# Altium project BE-PC_EXP_V100.PrjPcb (part 1 of 4)
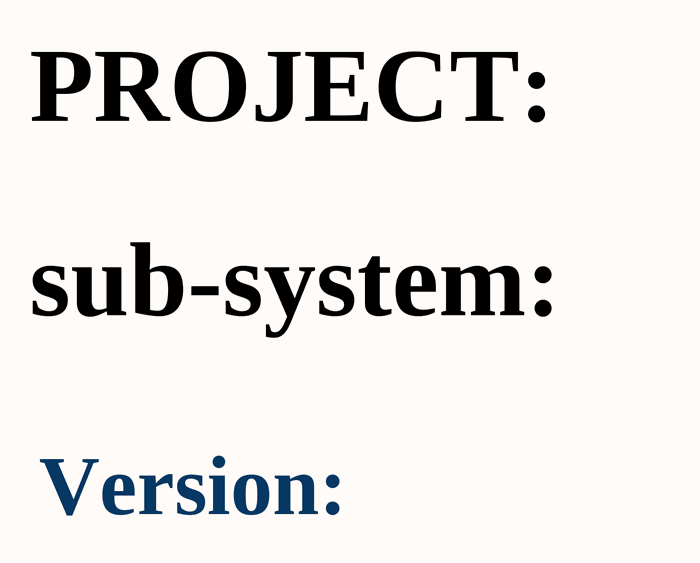
[diagram p0: 01_COVER PAGE.SchDoc]
ApprovedBy: Vu Pham; CheckedBy: Bao Bui; Date: 10/29/2025; DrawnBy: Cam Doan; MasterProject: BEE-PC; Revision: 1.0.0; SubSystem: EXP
29 sheets, 1256 parts. Net scope: flat (ports and power ports of the same name join across sheets).
Board file: BEE-PC_EXP_V100.PcbDoc
Sheets:
  01_COVER PAGE.SchDoc
  02_BLOCK DIAGRAM.SchDoc
  03_INDEX.SchDoc
  04_CONNECTOR_IN.SchDoc
  04_CONNECTOR_OUT.SchDoc
  04_CONNECTOR_OUT_2.SchDoc
  05_POWER_SAMA7.Doc.SchDoc
  05_POWER_MCU_1.SchDoc
  05_POWER_MCU_2.SchDoc
  06_SOM_USB_CARD.SchDoc
  06_SOM_Console.SchDoc
  06_SOM_CAM.SchDoc
  07_eMMC.SchDoc
  07_USB.SchDoc
  08_MCU.SchDoc
  09_MRAM_RTC_WDT.SchDoc
  10_NTC_TEMPSENSOR.SchDoc
  11_HEATER.SchDoc
  12_TEC.SchDoc
  13_FLOW_Sensor.SchDoc
  13_Sensors_Onboard.SchDoc
  14_HD4_PUMP.SchDoc
  15_SOLEDNOID.SchDoc
  15_SOLENOID 2.SchDoc
  MOUTING.SchDoc
  06_SAMA7G54-PMIC.SchDoc
  06_SAMA7G54-MPU.SchDoc
  06_SAMA7G54-PIO.SchDoc
  06_SAMA7G54-DDR3.SchDoc

## Sheet 01_COVER PAGE.SchDoc
size 420 x 297 mm; SheetNumber: 1; SheetTotal: 28

### Notes on the sheet
- PROJECT:
- sub-system:
- Version:
- Project:
- Sub-system:
- Design by:
- Sheet title:
- Sheet
- of
- Checked by:
- Approved by:
- Revision:
- Document No:
- Size:
- Date:
- A3

## Sheet 02_BLOCK DIAGRAM.SchDoc
size 420 x 297 mm; SheetNumber: 2; SheetTotal: 28

### Notes on the sheet
- Project:
- Sub-system:
- Design by:
- Sheet title:
- Sheet
- of
- Checked by:
- Approved by:
- Revision:
- Document No:
- Size:
- Date:
- A3

## Sheet 03_INDEX.SchDoc
size 420 x 297 mm; SheetNumber: 3; SheetTotal: 28
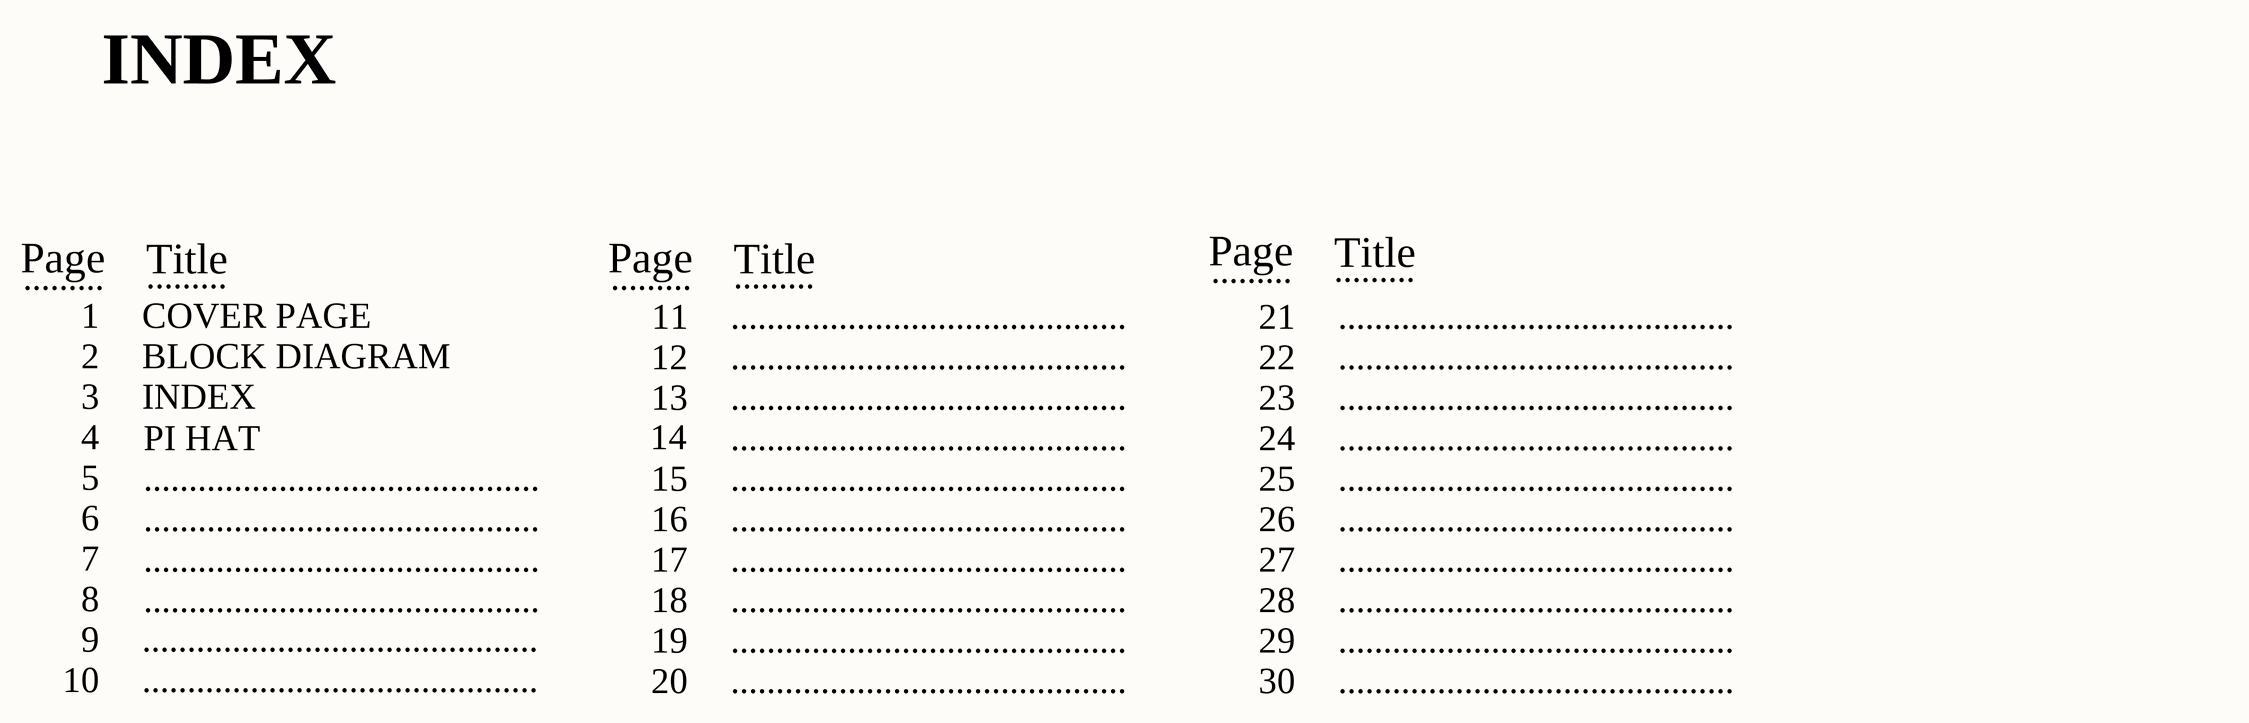
[diagram p1: 03_INDEX.SchDoc]

### Notes on the sheet
- INDEX
- Page
- .........
- Title
- 1
- 2
- COVER PAGE
- BLOCK DIAGRAM
- 11
- 12
- ............................................
- 21
- 22
- 3
- 4
- 14
- 13
- 23
- 5
- PI HAT
- 15
- 24
- 25
- 6
- 7
- 16
- 17
- 26
- 27
- 8
- 18
- 28
- 9
- 10
- 19
- 20
- 29
- 30
- Project:
- Sub-system:
- Design by:
- Sheet title:
- Sheet
- of
- Checked by:
- Approved by:
- Revision:
- Document No:
- Size:
- Date:
- A3

## Sheet 04_CONNECTOR_IN.SchDoc
size 420 x 297 mm; SheetNumber: 4; SheetTotal: 29
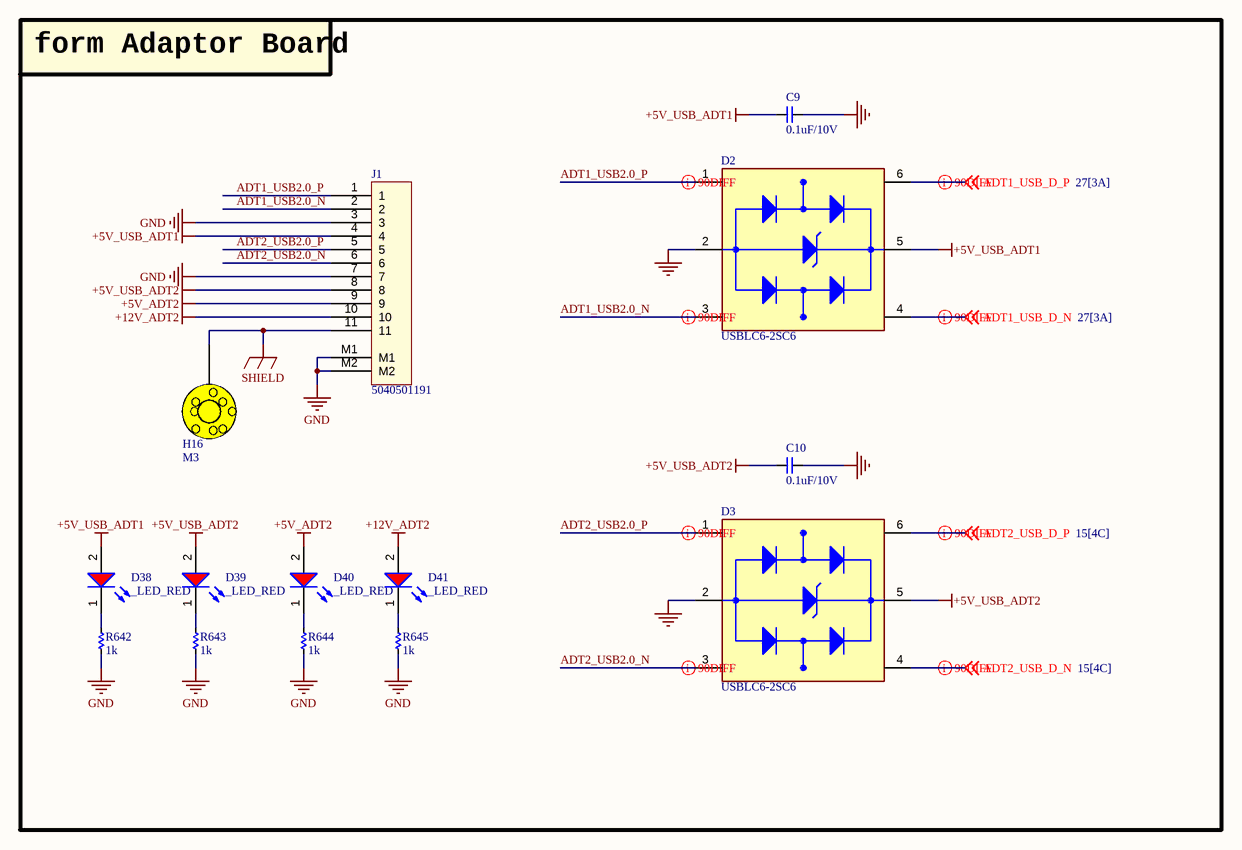
[diagram p2: 04_CONNECTOR_IN.SchDoc]

### Parts
C9  0.1uF/10V  [CAP_C_1005X60]
C10  0.1uF/10V  [CAP_C_1005X60]
D2  USBLC6-2SC6  [SOT95P280X145-6N]
D3  USBLC6-2SC6  [SOT95P280X145-6N]
D38  _LED_RED  [LED_0603]
D39  _LED_RED  [LED_0603]
D40  _LED_RED  [LED_0603]
D41  _LED_RED  [LED_0603]
H16  M3  [Testpoint_TH_D350H250]
J1  5040501191  [MOLEX_5040501191]
R642  1k  [RES_C_1005X40]
R643  1k  [RES_C_1005X40]
R644  1k  [RES_C_1005X40]
R645  1k  [RES_C_1005X40]

### Blocks framed on the sheet
form Adaptor Board: C9 C10 D2 D3 D38-D41 H16 J1 R642-R645

### Nets
+5V_ADT2: D40.2(A) J1.9
+5V_USB_ADT1: C9.2 D2.5(VBUS) D38.2(A) J1.4
+5V_USB_ADT2: C10.2 D3.5(VBUS) D39.2(A) J1.8
+12V_ADT2: D41.2(A) J1.10
GND: C9.1 C10.1 D2.2(GND) D3.2(GND) J1.3 J1.7 J1.M1 J1.M2 R642.1 R643.1 R644.1 R645.1
SHIELD: H16.1 J1.11
ADT1_USB2.0_N: D2.3(I/O2_IN) J1.2
ADT1_USB2.0_P: D2.1(I/O1_IN) J1.1
ADT1_USB_D_N: D2.4(I/O2_OUT) ; off-sheet ADT1_USB_D_N
ADT1_USB_D_P: D2.6(I/O1_OUT) ; off-sheet ADT1_USB_D_P
ADT2_USB2.0_N: D3.3(I/O2_IN) J1.6
ADT2_USB2.0_P: D3.1(I/O1_IN) J1.5
ADT2_USB_D_N: D3.4(I/O2_OUT) ; off-sheet ADT2_USB_D_N
ADT2_USB_D_P: D3.6(I/O1_OUT) ; off-sheet ADT2_USB_D_P
NetD38_1: D38.1(K) R642.2
NetD39_1: D39.1(K) R643.2
NetD40_1: D40.1(K) R644.2
NetD41_1: D41.1(K) R645.2

### Layout directives
differential pair; differential pair class DIFF90: ADT1_USB2.0_N, ADT1_USB2.0_P, ADT1_USB_D_N, ADT1_USB_D_P, ADT2_USB2.0_N, ADT2_USB2.0_P, ADT2_USB_D_N, ADT2_USB_D_P

### Notes on the sheet
- Project:
- Sub-system:
- Design by:
- Sheet title:
- Sheet
- of
- Checked by:
- Approved by:
- Revision:
- Document No:
- Size:
- Date:
- A3

### Library data of the parts
C9 C10 = _CAP_C_2: CAP CHIP
D2 D3 = USBLC6-2SC6: 17V Clamp 5A (8/20Âµs) Ipp Tvs Diode Surface Mount SOT-23-6; MF: STMicroelectronics; Value: *; SnapEDA_Link: https://www.snapeda.com/parts/USBLC6-2SC6/STMicroelectronics/view-part/?ref=snap; Check_prices: https://www.snapeda.com/parts/USBLC6-2SC6/STMicroelectronics/view-part/?ref=eda; Purchase-URL: https://pricing.snapeda.com/search/part/USBLC6-2SC6/?ref=eda; Price: None; Availability: In Stock; Package: SOT-23-6 STMicroelectronics; MP: USBLC6-2SC6
H16 = HEX-M3
J1 = Header 11x1_2M
R642-R645 = _RES_B_2: RES

## Sheet 04_CONNECTOR_OUT.SchDoc
size 420 x 297 mm; SheetNumber: 5; SheetTotal: 28
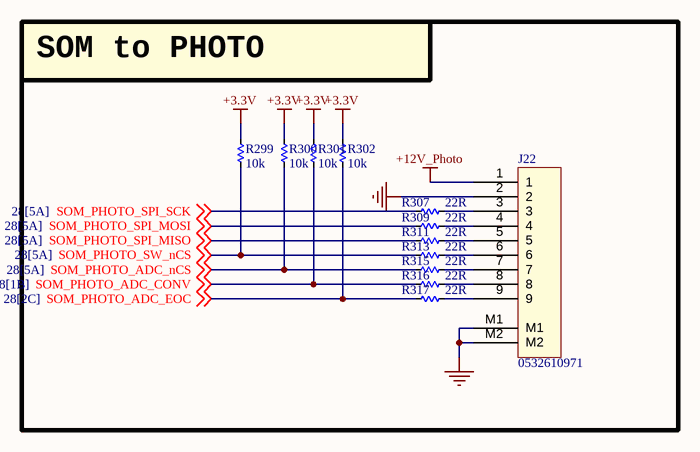
[diagram p3: 04_CONNECTOR_OUT.SchDoc]

### Parts
J22  0532610971  [MOLEX_0532610971]
R299  10k  [RES_C_1005X40]
R300  10k  [RES_C_1005X40]
R301  10k  [RES_C_1005X40]
R302  10k  [RES_C_1005X40]
R307  22R  [RES_C_1005X40]
R309  22R  [RES_C_1005X40]
R311  22R  [RES_C_1005X40]
R313  22R  [RES_C_1005X40]
R315  22R  [RES_C_1005X40]
R316  22R  [RES_C_1005X40]
R317  22R  [RES_C_1005X40]

### Blocks framed on the sheet
SOM to PHOTO: J22 R299-R302 R307 R309 R311 R313 R315-R317

### Nets
+3.3V: R299.1 R300.1 R301.1 R302.1
+12V_Photo: J22.1
GND: J22.2 J22.M1 J22.M2
SOM_PHOTO_ADC_CONV: R301.2 R316.1 ; off-sheet SOM_PHOTO_ADC_CONV
SOM_PHOTO_ADC_EOC: R302.2 R317.1 ; off-sheet SOM_PHOTO_ADC_EOC
SOM_PHOTO_ADC_nCS: R300.2 R315.1 ; off-sheet SOM_PHOTO_ADC_nCS
SOM_PHOTO_SPI_MISO: R311.1 ; off-sheet SOM_PHOTO_SPI_MISO
SOM_PHOTO_SPI_MOSI: R309.1 ; off-sheet SOM_PHOTO_SPI_MOSI
SOM_PHOTO_SPI_SCK: R307.1 ; off-sheet SOM_PHOTO_SPI_SCK
SOM_PHOTO_SW_nCS: R299.2 R313.1 ; off-sheet SOM_PHOTO_SW_nCS
NetJ22_3: J22.3 R307.2
NetJ22_4: J22.4 R309.2
NetJ22_5: J22.5 R311.2
NetJ22_6: J22.6 R313.2
NetJ22_7: J22.7 R315.2
NetJ22_8: J22.8 R316.2
NetJ22_9: J22.9 R317.2

### Notes on the sheet
- Project:
- Sub-system:
- Design by:
- Sheet title:
- Sheet
- of
- Checked by:
- Approved by:
- Revision:
- Document No:
- Size:
- Date:
- A3

### Library data of the parts
J22 = Header 9x1_2M
R299-R302 R307 R309 R311 R313 R315-R317 = _RES_B_2: RES

## Sheet 04_CONNECTOR_OUT_2.SchDoc
size 420 x 297 mm; SheetNumber: 6; SheetTotal: 29
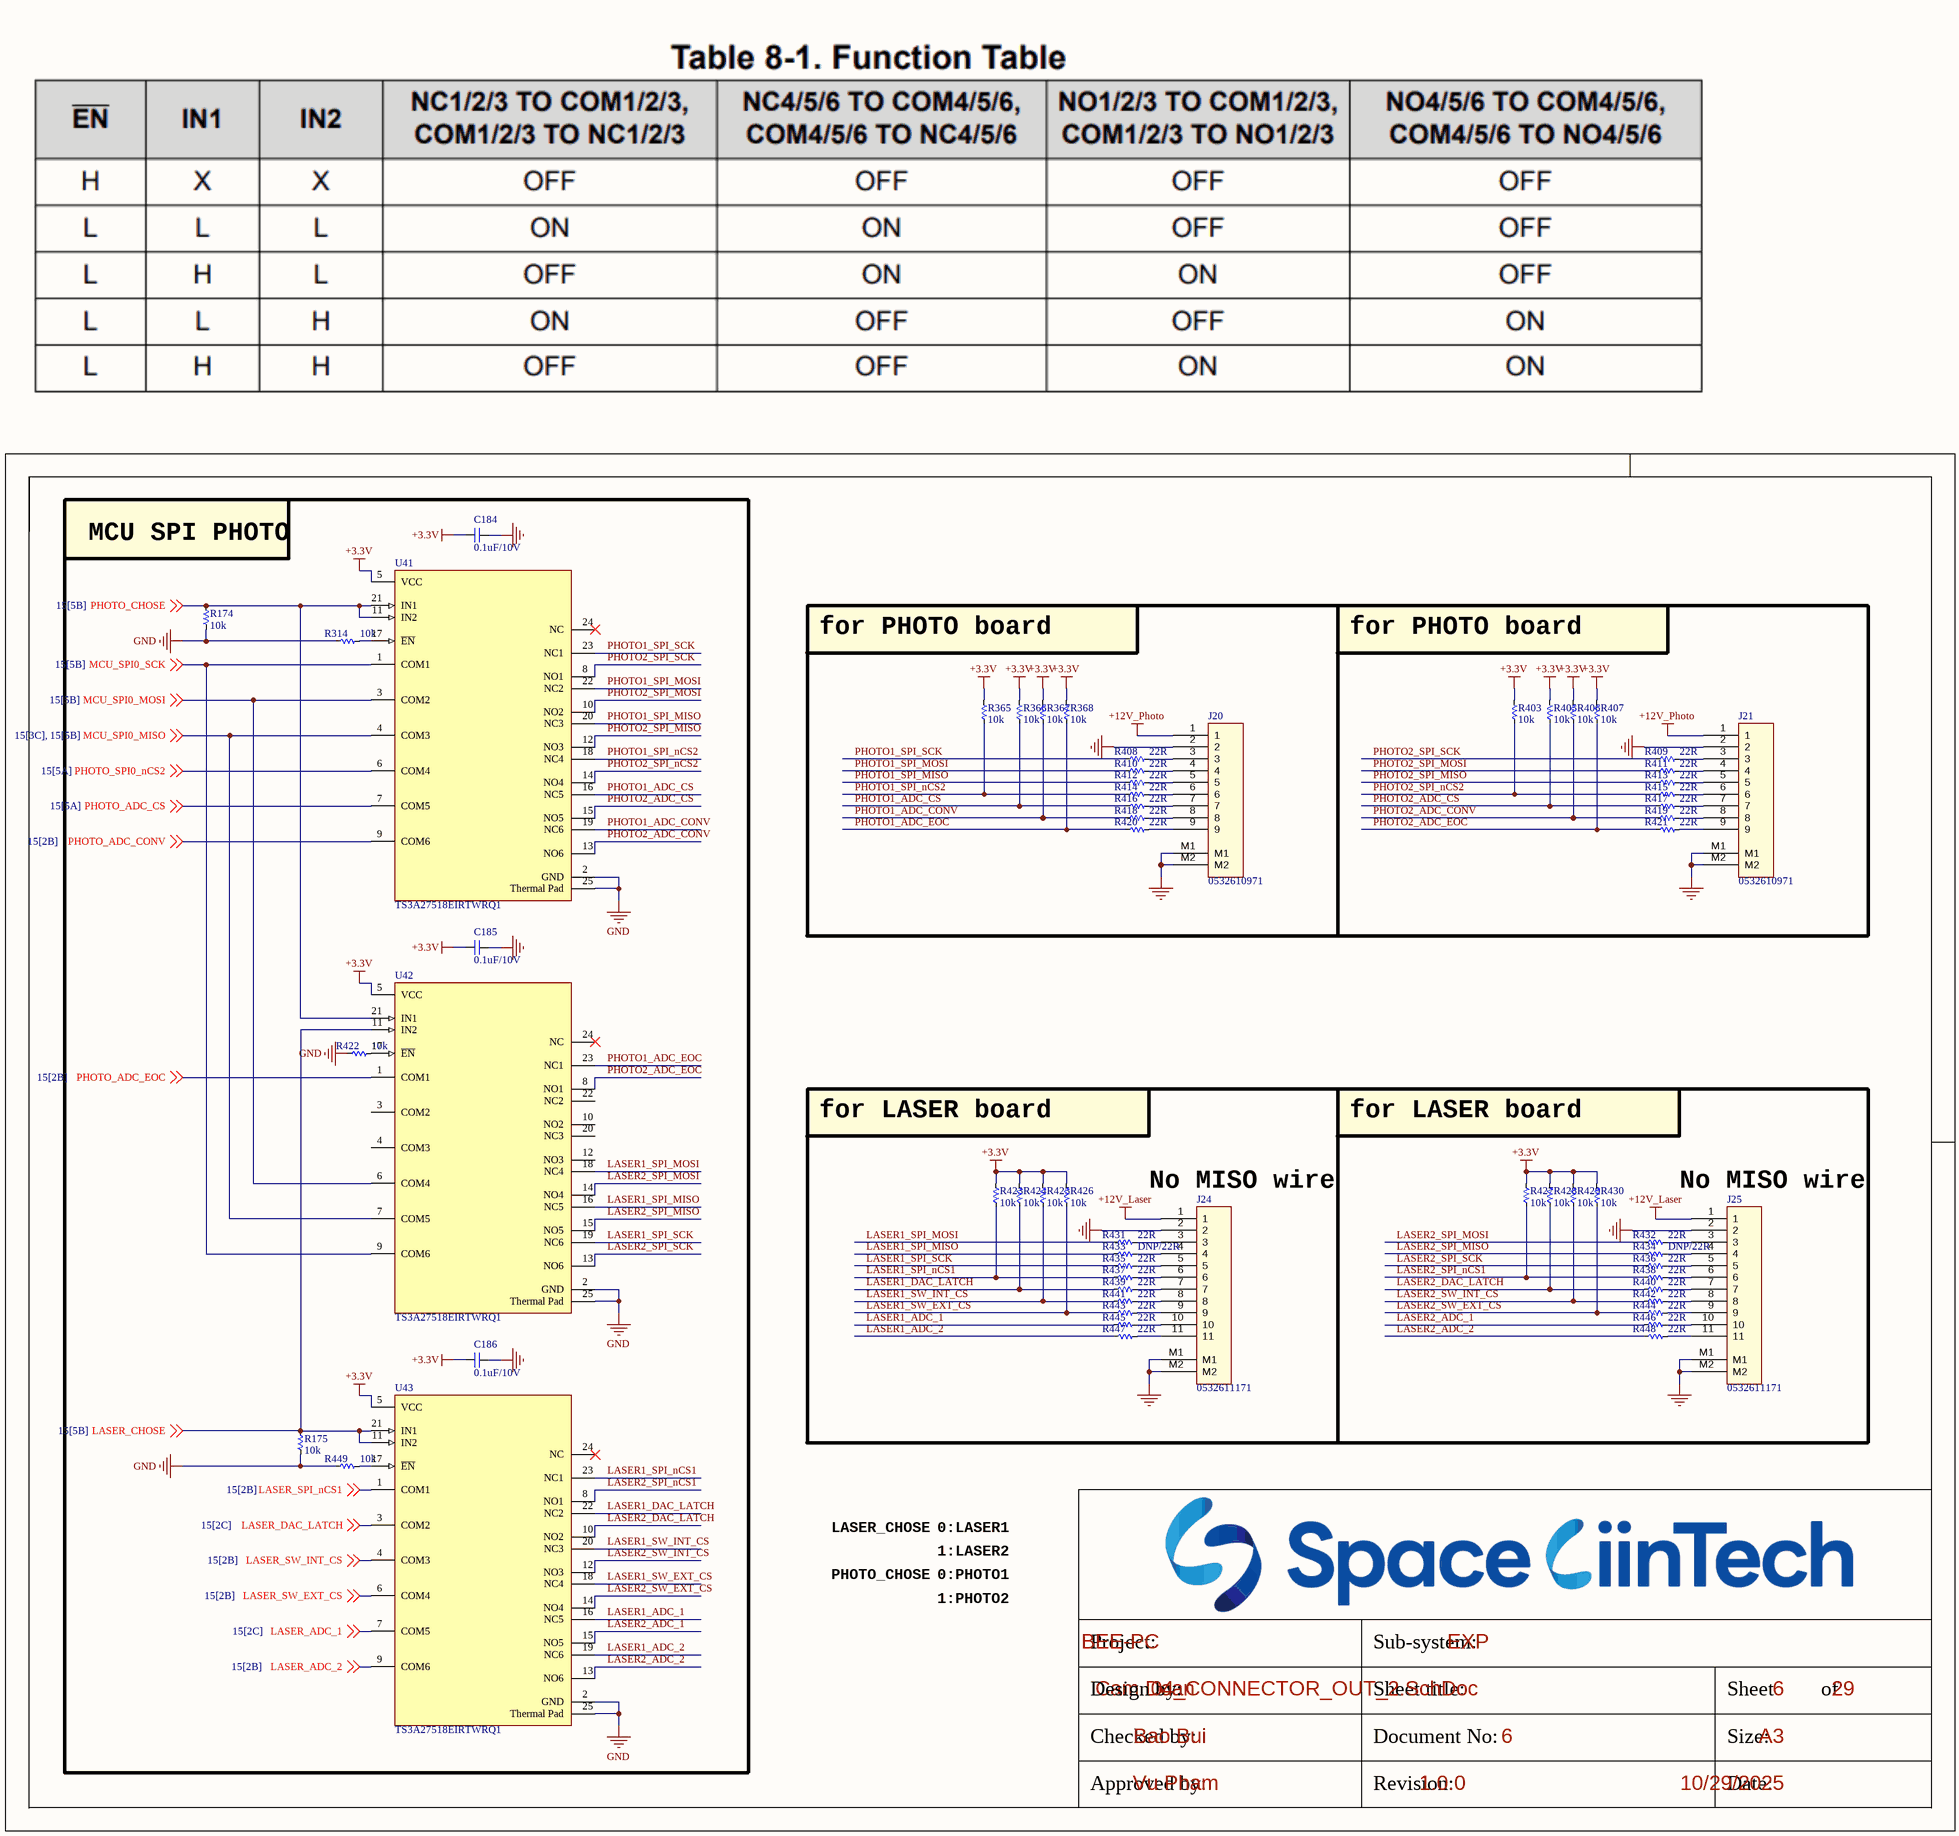
[diagram p4: 04_CONNECTOR_OUT_2.SchDoc]

### Parts
C184  0.1uF/10V  [CAP_C_1005X60]
C185  0.1uF/10V  [CAP_C_1005X60]
C186  0.1uF/10V  [CAP_C_1005X60]
J20  0532610971  [MOLEX_0532610971]
J21  0532610971  [MOLEX_0532610971]
J24  0532611171  [MOLEX_0532611171]
J25  0532611171  [MOLEX_0532611171]
R174  10k  [RES_C_1005X40]
R175  10k  [RES_C_1005X40]
R314  10k  [RES_C_1005X40]
R365  10k  [RES_C_1005X40]
R366  10k  [RES_C_1005X40]
R367  10k  [RES_C_1005X40]
R368  10k  [RES_C_1005X40]
R403  10k  [RES_C_1005X40]
R405  10k  [RES_C_1005X40]
R406  10k  [RES_C_1005X40]
R407  10k  [RES_C_1005X40]
R408  22R  [RES_C_1005X40]
R409  22R  [RES_C_1005X40]
R410  22R  [RES_C_1005X40]
R411  22R  [RES_C_1005X40]
R412  22R  [RES_C_1005X40]
R413  22R  [RES_C_1005X40]
R414  22R  [RES_C_1005X40]
R415  22R  [RES_C_1005X40]
R416  22R  [RES_C_1005X40]
R417  22R  [RES_C_1005X40]
R418  22R  [RES_C_1005X40]
R419  22R  [RES_C_1005X40]
R420  22R  [RES_C_1005X40]
R421  22R  [RES_C_1005X40]
R422  10k  [RES_C_1005X40]
R423  10k  [RES_C_1005X40]
R424  10k  [RES_C_1005X40]
R425  10k  [RES_C_1005X40]
R426  10k  [RES_C_1005X40]
R427  10k  [RES_C_1005X40]
R428  10k  [RES_C_1005X40]
R429  10k  [RES_C_1005X40]
R430  10k  [RES_C_1005X40]
R431  22R  [RES_C_1005X40]
R432  22R  [RES_C_1005X40]
R433  DNP/22R  [RES_C_1005X40]
R434  DNP/22R  [RES_C_1005X40]
R435  22R  [RES_C_1005X40]
R436  22R  [RES_C_1005X40]
R437  22R  [RES_C_1005X40]
R438  22R  [RES_C_1005X40]
R439  22R  [RES_C_1005X40]
R440  22R  [RES_C_1005X40]
R441  22R  [RES_C_1005X40]
R442  22R  [RES_C_1005X40]
R443  22R  [RES_C_1005X40]
R444  22R  [RES_C_1005X40]
R445  22R  [RES_C_1005X40]
R446  22R  [RES_C_1005X40]
R447  22R  [RES_C_1005X40]
R448  22R  [RES_C_1005X40]
R449  10k  [RES_C_1005X40]
U41  TS3A27518EIRTWRQ1  [FP-RTW0024B-IPC_A]
U42  TS3A27518EIRTWRQ1  [FP-RTW0024B-IPC_A]
U43  TS3A27518EIRTWRQ1  [FP-RTW0024B-IPC_A]

### Blocks framed on the sheet
MCU SPI PHOTO: C184-C186 R174 R175 R314 R422 R449 U41-U43
for PHOTO board: J20 R365-R368 R408 R410 R412 R414 R416 R418 R420
for PHOTO board: J21 R403 R405-R407 R409 R411 R413 R415 R417 R419 R421

### Nets
+3.3V: C184.2 C185.2 C186.2 R365.1 R366.1 R367.1 R368.1 R403.1 R405.1 R406.1 R407.1 R423.1 R424.1 R425.1 R426.1 R427.1 R428.1 R429.1 R430.1 U41.5(VCC) U42.5(VCC) U43.5(VCC)
+12V_Laser: J24.1 J25.1
+12V_Photo: J20.1 J21.1
GND: C184.1 C185.1 C186.1 J20.2 J20.M1 J20.M2 J21.2 J21.M1 J21.M2 J24.2 J24.M1 J24.M2 J25.2 J25.M1 J25.M2 R174.1 R175.1 R314.1 R422.1 R449.1 U41.2(GND) U41.25(Thermal_Pad) U42.2(GND) U42.25(Thermal_Pad) U43.2(GND) U43.25(Thermal_Pad)
LASER1_ADC_1: R445.1 U43.16(NC5)
LASER1_ADC_2: R447.1 U43.19(NC6)
LASER1_DAC_LATCH: R424.2 R439.1 U43.22(NC2)
LASER1_SPI_MISO: R433.1 U42.16(NC5)
LASER1_SPI_MOSI: R431.1 U42.18(NC4)
LASER1_SPI_nCS1: R423.2 R437.1 U43.23(NC1)
LASER1_SPI_SCK: R435.1 U42.19(NC6)
LASER1_SW_EXT_CS: R426.2 R443.1 U43.18(NC4)
LASER1_SW_INT_CS: R425.2 R441.1 U43.20(NC3)
LASER2_ADC_1: R446.1 U43.15(NO5)
LASER2_ADC_2: R448.1 U43.13(NO6)
LASER2_DAC_LATCH: R428.2 R440.1 U43.10(NO2)
LASER2_SPI_MISO: R434.1 U42.15(NO5)
LASER2_SPI_MOSI: R432.1 U42.14(NO4)
LASER2_SPI_nCS1: R427.2 R438.1 U43.8(NO1)
LASER2_SPI_SCK: R436.1 U42.13(NO6)
LASER2_SW_EXT_CS: R430.2 R444.1 U43.14(NO4)
LASER2_SW_INT_CS: R429.2 R442.1 U43.12(NO3)
LASER_ADC_1: U43.7(COM5) ; off-sheet LASER_ADC_1
LASER_ADC_2: U43.9(COM6) ; off-sheet LASER_ADC_2
LASER_CHOSE: R175.2 U42.11(IN2) U43.11(IN2) U43.21(IN1) ; off-sheet LASER_CHOSE
LASER_DAC_LATCH: U43.3(COM2) ; off-sheet LASER_DAC_LATCH
LASER_SPI_nCS1: U43.1(COM1) ; off-sheet LASER_SPI_nCS1
LASER_SW_EXT_CS: U43.6(COM4) ; off-sheet LASER_SW_EXT_CS
LASER_SW_INT_CS: U43.4(COM3) ; off-sheet LASER_SW_INT_CS
MCU_SPI0_MISO: U41.4(COM3) U42.7(COM5) ; off-sheet MCU_SPI0_MISO
MCU_SPI0_MOSI: U41.3(COM2) U42.6(COM4) ; off-sheet MCU_SPI0_MOSI
MCU_SPI0_SCK: U41.1(COM1) U42.9(COM6) ; off-sheet MCU_SPI0_SCK
PHOTO1_ADC_CONV: R367.2 R418.1 U41.19(NC6)
PHOTO1_ADC_CS: R366.2 R416.1 U41.16(NC5)
PHOTO1_ADC_EOC: R368.2 R420.1 U42.23(NC1)
PHOTO1_SPI_MISO: R412.1 U41.20(NC3)
PHOTO1_SPI_MOSI: R410.1 U41.22(NC2)
PHOTO1_SPI_nCS2: R365.2 R414.1 U41.18(NC4)
PHOTO1_SPI_SCK: R408.1 U41.23(NC1)
PHOTO2_ADC_CONV: R406.2 R419.1 U41.13(NO6)
PHOTO2_ADC_CS: R405.2 R417.1 U41.15(NO5)
PHOTO2_ADC_EOC: R407.2 R421.1 U42.8(NO1)
PHOTO2_SPI_MISO: R413.1 U41.12(NO3)
PHOTO2_SPI_MOSI: R411.1 U41.10(NO2)
PHOTO2_SPI_nCS2: R403.2 R415.1 U41.14(NO4)
PHOTO2_SPI_SCK: R409.1 U41.8(NO1)
PHOTO_ADC_CONV: U41.9(COM6) ; off-sheet PHOTO_ADC_CONV
PHOTO_ADC_CS: U41.7(COM5) ; off-sheet PHOTO_ADC_CS
PHOTO_ADC_EOC: U42.1(COM1) ; off-sheet PHOTO_ADC_EOC
PHOTO_CHOSE: R174.2 U41.11(IN2) U41.21(IN1) U42.21(IN1) ; off-sheet PHOTO_CHOSE
PHOTO_SPI0_nCS2: U41.6(COM4) ; off-sheet PHOTO_SPI0_nCS2
NetJ20_3: J20.3 R408.2
NetJ20_4: J20.4 R410.2
NetJ20_5: J20.5 R412.2
NetJ20_6: J20.6 R414.2
NetJ20_7: J20.7 R416.2
NetJ20_8: J20.8 R418.2
NetJ20_9: J20.9 R420.2
NetJ21_3: J21.3 R409.2
NetJ21_4: J21.4 R411.2
NetJ21_5: J21.5 R413.2
NetJ21_6: J21.6 R415.2
NetJ21_7: J21.7 R417.2
NetJ21_8: J21.8 R419.2
NetJ21_9: J21.9 R421.2
NetJ24_3: J24.3 R431.2
NetJ24_4: J24.4 R433.2
NetJ24_5: J24.5 R435.2
NetJ24_6: J24.6 R437.2
NetJ24_7: J24.7 R439.2
NetJ24_8: J24.8 R441.2
NetJ24_9: J24.9 R443.2
NetJ24_10: J24.10 R445.2
NetJ24_11: J24.11 R447.2
NetJ25_3: J25.3 R432.2
NetJ25_4: J25.4 R434.2
NetJ25_5: J25.5 R436.2
NetJ25_6: J25.6 R438.2
NetJ25_7: J25.7 R440.2
NetJ25_8: J25.8 R442.2
NetJ25_9: J25.9 R444.2
NetJ25_10: J25.10 R446.2
NetJ25_11: J25.11 R448.2
NetR314_2: R314.2 U41.17(~{EN})
NetR422_2: R422.2 U42.17(~{EN})
NetR449_2: R449.2 U43.17(~{EN})

Not connected (* = marked no-connect by the designer): U41 24(NC)*; U42 3(COM2) 4(COM3) 10(NO2) 12(NO3) 20(NC3) 22(NC2) 24(NC)*; U43 24(NC)*

### Notes on the sheet
- for LASER board
- (near J24) No MISO wire
- (near J25) No MISO wire
- LASER_CHOSE
- 0:LASER1
- 1:LASER2
- PHOTO_CHOSE
- 0:PHOTO1
- 1:PHOTO2
- Project:
- Sub-system:
- Design by:
- Sheet title:
- Sheet
- of
- Checked by:
- Approved by:
- Revision:
- Document No:
- Size:
- Date:
- A3

### Library data of the parts
C184-C186 = _CAP_C_2: CAP CHIP
J20 J21 = Header 9x1_2M
J24 J25 = Header 11x1_2M
R174 R175 R314 R365-R368 R403 R405-R449 = _RES_B_2: RES
U41-U43 = CMP-04892-000110-1: IC MUX/DEMUX 1X2 24WQFN; Supply Type: Single; Max Supply Voltage: 3.6V; Number of Circuits: 6; On-State Resistance: 6.2R; Turn-Off Delay Time: 70ns; -3db Bandwidth: 240MHz; Operating Supply Current: 40nA; Min Supply Voltage: 1.65V; Logic Function: Multiplexer; Turn-On Delay Time: 68ns; Min Operating Temperature: -40°C; Packaging: Tape and Reel; Case/Package: QFN; Package Quantity: 1; RoHS Compliant: Yes; Lead Free: Lead Free; Bandwidth: 240MHz; Max Operating Temperature: 105°C; Number of Channels: 6; Series: Automotive, AEC-Q100; Number of Pins: 24; Mount: Surface Mount

## Sheet 05_POWER_SAMA7.Doc.SchDoc
size 420 x 297 mm; SheetNumber: 7; SheetTotal: 29
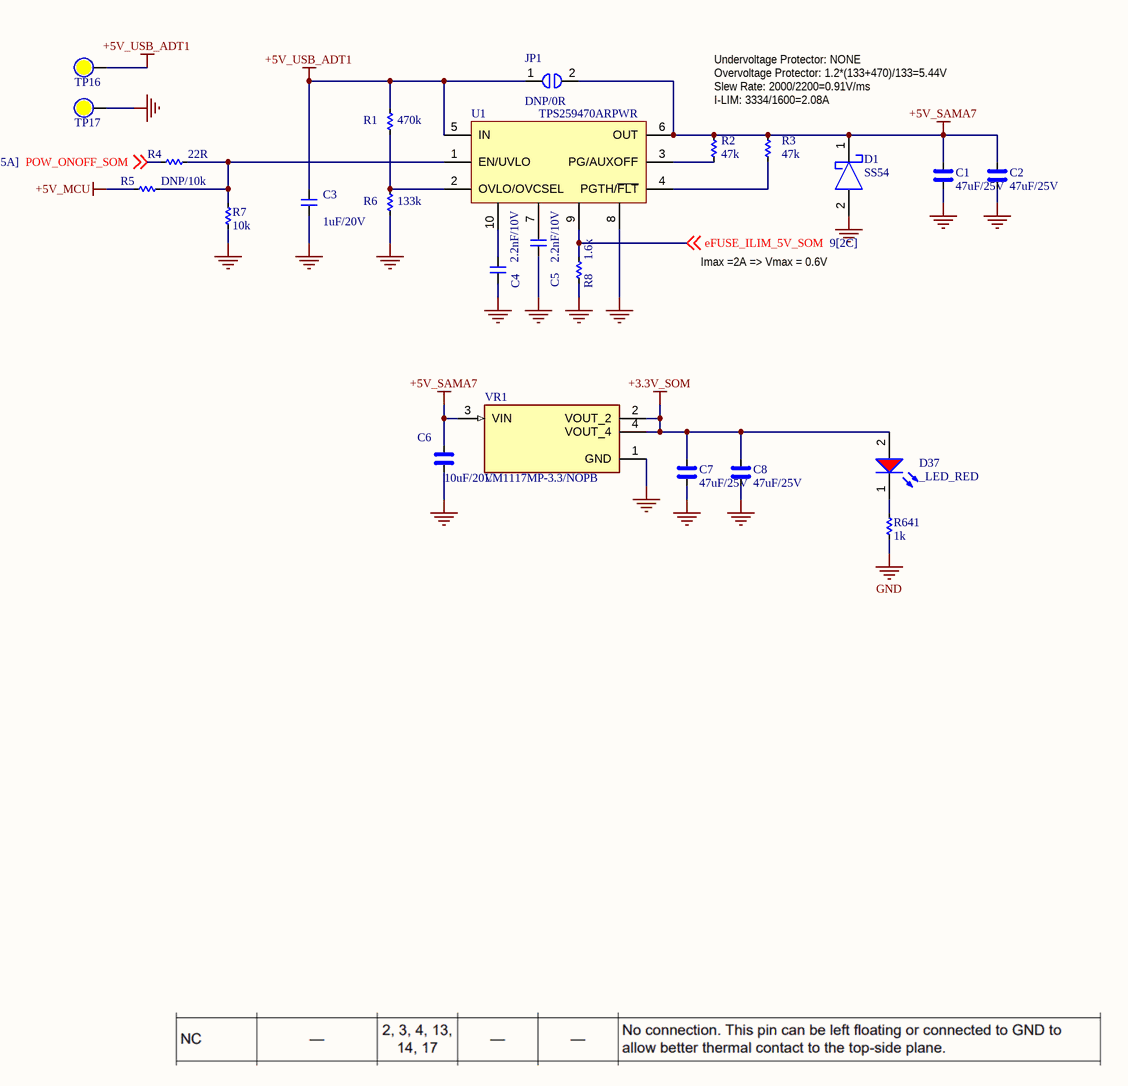
[diagram p5: 05_POWER_SAMA7.Doc.SchDoc]

### Parts
C1  47uF/25V  [CAP_C_3225X80]
C2  47uF/25V  [CAP_C_3225X80]
C3  1uF/20V  [CAP_C_1005X60]
C4  2.2nF/10V  [CAP_C_1005X60]
C5  2.2nF/10V  [CAP_C_1005X60]
C6  10uF/20V  [CAP_C_2012X110]
C7  47uF/25V  [CAP_C_3225X80]
C8  47uF/25V  [CAP_C_3225X80]
D1  SS54  [DO-214AC_SMA]
D37  _LED_RED  [LED_0603]
JP1  DNP/0R  [RES_C_1608X60]
R1  470k  [RES_C_1005X40]
R2  47k  [RES_C_1005X40]
R3  47k  [RES_C_1005X40]
R4  22R  [RES_C_1005X40]
R5  DNP/10k  [RES_C_1005X40]
R6  133k  [RES_C_1005X40]
R7  10k  [RES_C_1005X40]
R8  1.6k  [RES_C_1005X40]
R641  1k  [RES_C_1005X40]
TP16  (no value)  [Testpoint_TH_D130H80]  (no BOM)
TP17  (no value)  [Testpoint_TH_D130H80]  (no BOM)
U1  TPS259470ARPWR  [VQFN-HR-10]
VR1  LM1117MP-3.3/NOPB  [VREG_LM1117MP-3.3/NOPB]

### Nets
+3.3V_SOM: C7.2 C8.2 D37.2(A) VR1.2(VOUT_2) VR1.4(VOUT_4)
+5V_MCU: R5.2
+5V_SAMA7: C1.2 C2.2 C6.1 D1.1 JP1.2 R2.2 R3.2 U1.6(OUT) VR1.3(VIN)
+5V_USB_ADT1: C3.2 JP1.1 R1.2 TP16.1 U1.5(IN)
GND: C1.1 C2.1 C3.1 C4.1 C5.1 C6.2 C7.1 C8.1 D1.2 R6.1 R7.2 R8.1 R641.1 TP17.1 U1.8 VR1.1(GND)
eFUSE_ILIM_5V_SOM: R8.2 U1.9 ; off-sheet eFUSE_ILIM_5V_SOM
POW_ONOFF_SOM: R4.2 ; off-sheet POW_ONOFF_SOM
NetC4_2: C4.2 U1.10
NetC5_2: C5.2 U1.7
NetD37_1: D37.1(K) R641.2
NetR1_1: R1.1 R6.2 U1.2(OVLO/OVCSEL)
NetR2_1: R2.1 U1.3(PG/AUXOFF)
NetR3_1: R3.1 U1.4(PGTH/~{FLT})
NetR4_1: R4.1 R5.1 R7.1 U1.1(EN/UVLO)

### Notes on the sheet
- Undervoltage Protector: NONE
- Overvoltage Protector: 1.2*(133+470)/133=5.44V
- Slew Rate: 2000/2200=0.91V/ms
- I-LIM: 3334/1600=2.08A
- Imax =2A => Vmax = 0.6V
- Project:
- Sub-system:
- Design by:
- Sheet title:
- Sheet
- of
- Checked by:
- Approved by:
- Revision:
- Document No:
- Size:
- Date:
- A3

### Library data of the parts
C1 C2 C6-C8 = _CAP_C_High_2: CAP CHIP High Value
C3-C5 = _CAP_C_2: CAP CHIP
D1 = SS54: DIODE SCHOTTKY 60V 3A DO214AA
JP1 = JUMPER_1_1
R1-R8 R641 = _RES_B_2: RES
TP16 TP17 = Test Point: Solder: NF
VR1 = LM1117MP-3.3/NOPB: 800-mA 15-V linear voltage regulator; MF: Texas Instruments; SnapEDA_Link: https://www.snapeda.com/parts/LM1117MP-3.3/NOPB/Texas+Instruments/view-part/?ref=snap; Package: SOT-223-4 Texas Instruments; Value: *; MP: LM1117MP-3.3/NOPB; Check_prices: https://www.snapeda.com/parts/LM1117MP-3.3/NOPB/Texas+Instruments/view-part/?ref=eda

## Sheet 05_POWER_MCU_1.SchDoc
size 420 x 297 mm; SheetNumber: 8; SheetTotal: 29
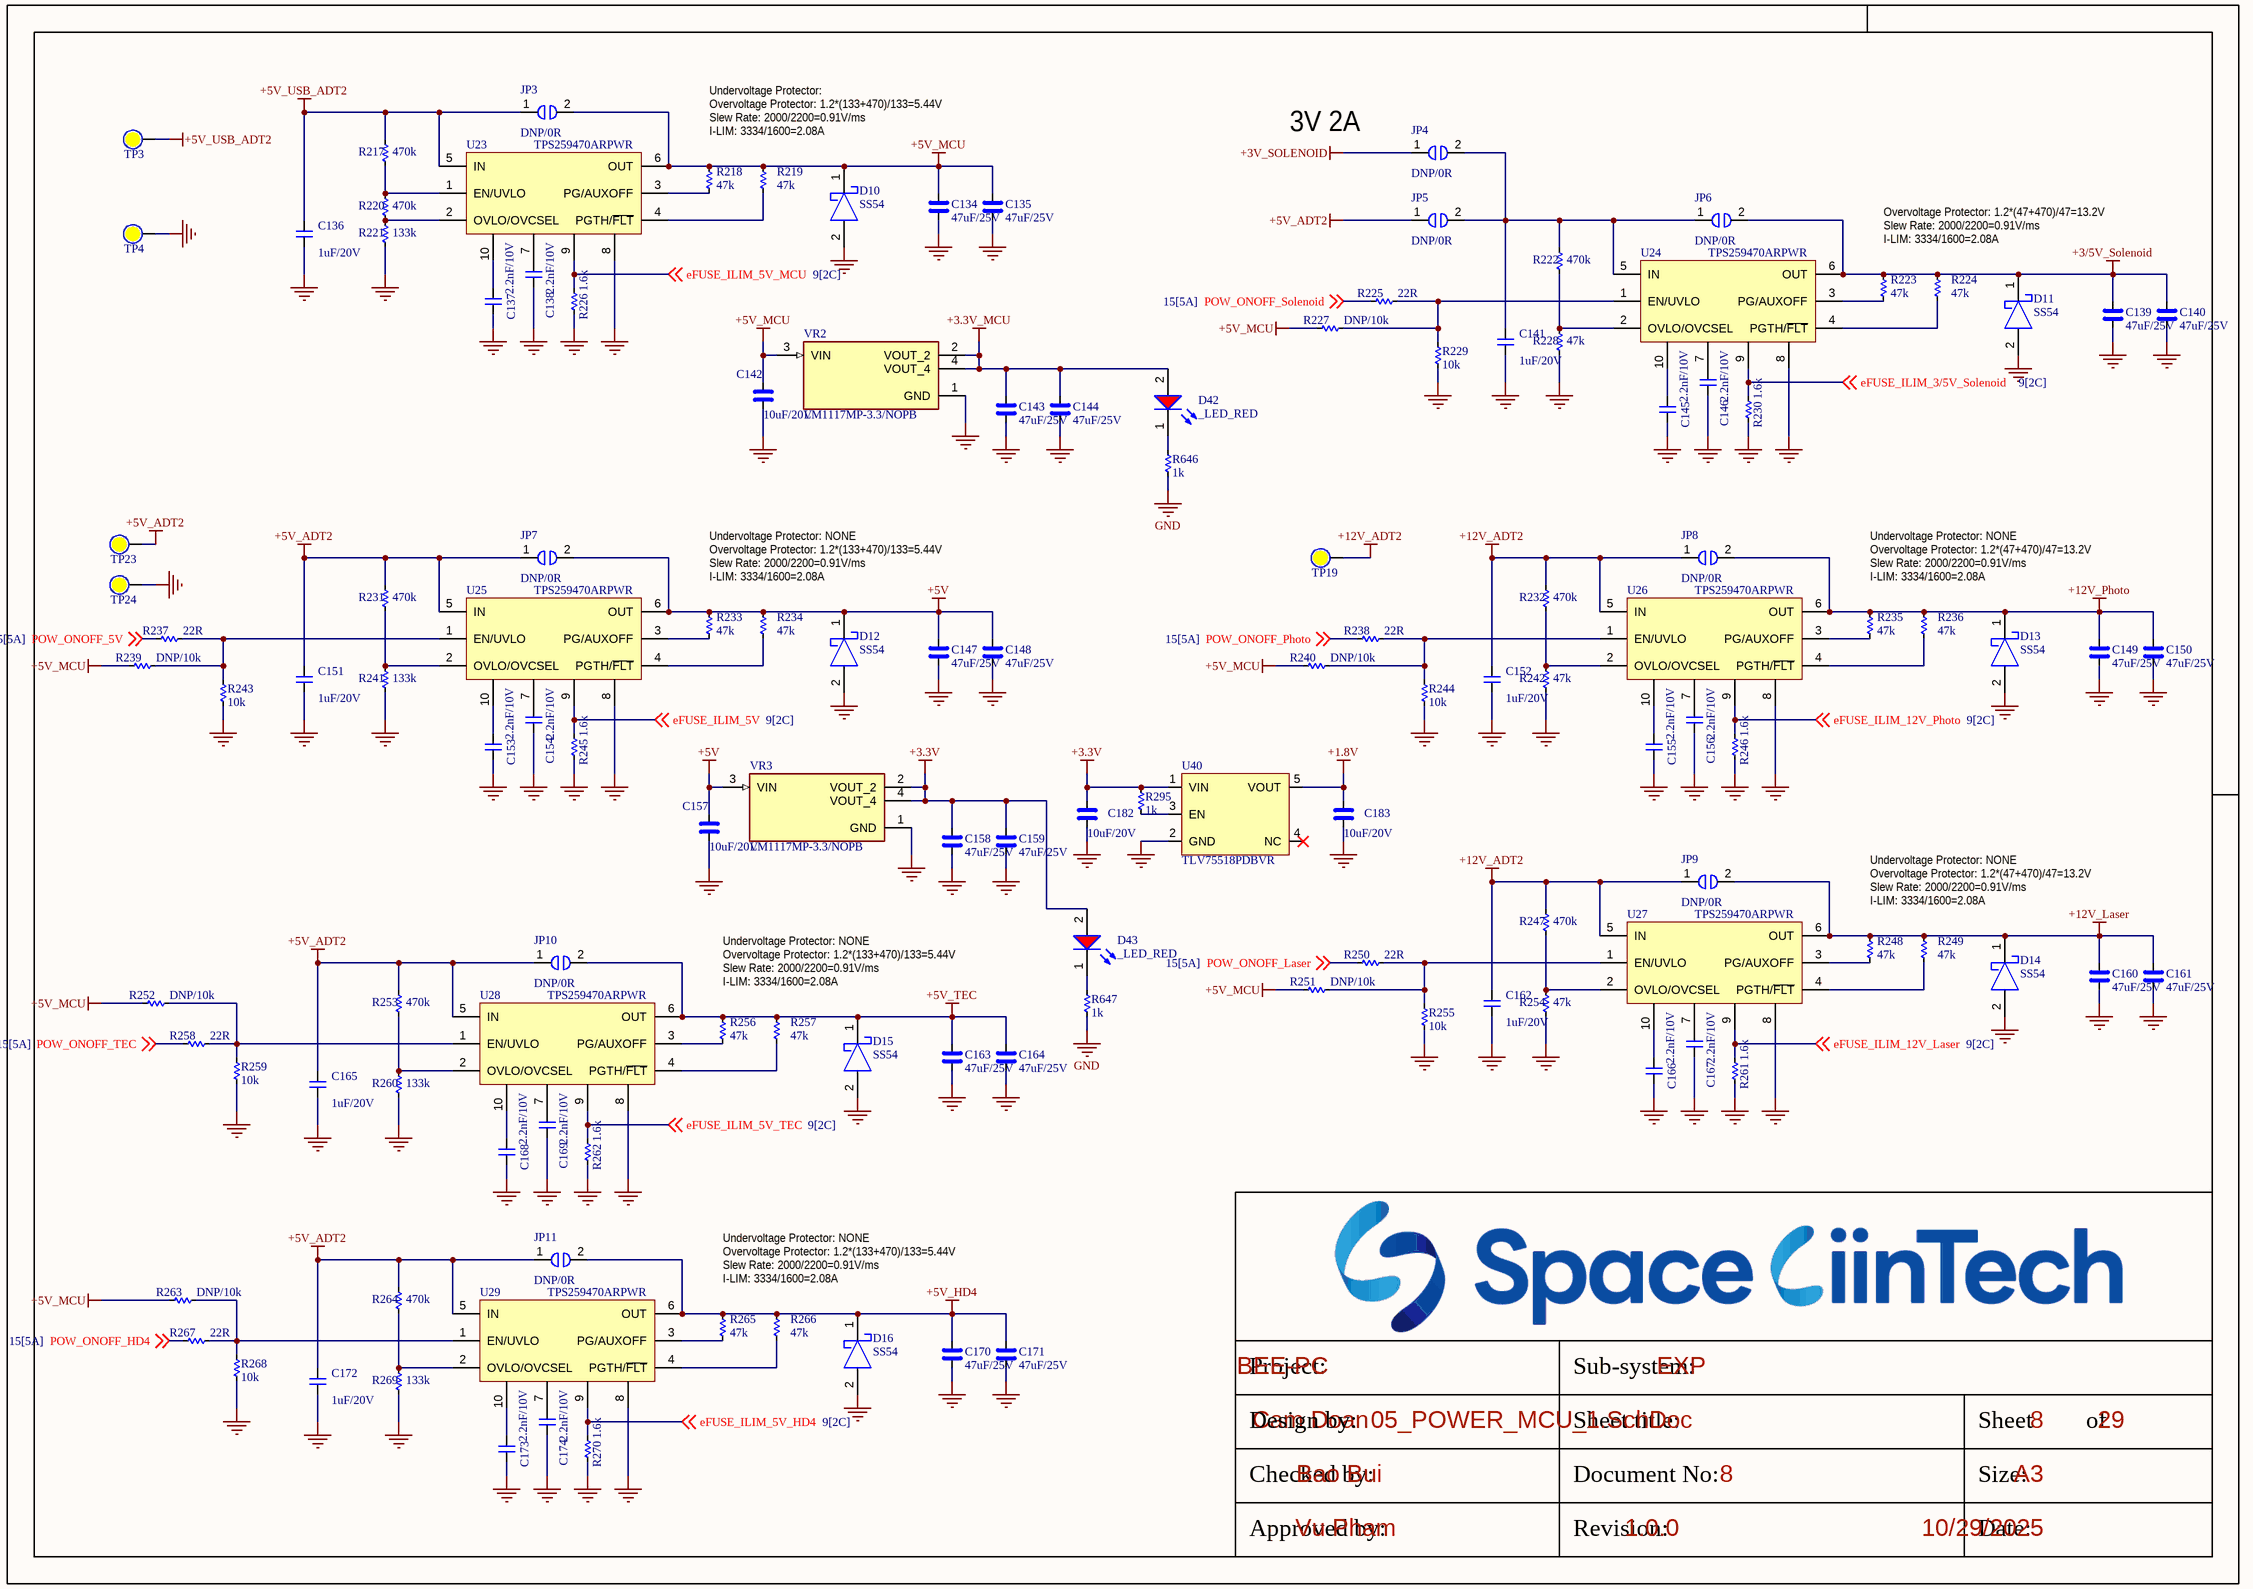
[diagram p6: 05_POWER_MCU_1.SchDoc]

### Parts
C134  47uF/25V  [CAP_C_3225X80]
C135  47uF/25V  [CAP_C_3225X80]
C136  1uF/20V  [CAP_C_1005X60]
C137  2.2nF/10V  [CAP_C_1005X60]
C138  2.2nF/10V  [CAP_C_1005X60]
C139  47uF/25V  [CAP_C_3225X80]
C140  47uF/25V  [CAP_C_3225X80]
C141  1uF/20V  [CAP_C_1005X60]
C142  10uF/20V  [CAP_C_2012X110]
C143  47uF/25V  [CAP_C_3225X80]
C144  47uF/25V  [CAP_C_3225X80]
C145  2.2nF/10V  [CAP_C_1005X60]
C146  2.2nF/10V  [CAP_C_1005X60]
C147  47uF/25V  [CAP_C_3225X80]
C148  47uF/25V  [CAP_C_3225X80]
C149  47uF/25V  [CAP_C_3225X80]
C150  47uF/25V  [CAP_C_3225X80]
C151  1uF/20V  [CAP_C_1005X60]
C152  1uF/20V  [CAP_C_1005X60]
C153  2.2nF/10V  [CAP_C_1005X60]
C154  2.2nF/10V  [CAP_C_1005X60]
C155  2.2nF/10V  [CAP_C_1005X60]
C156  2.2nF/10V  [CAP_C_1005X60]
C157  10uF/20V  [CAP_C_2012X110]
C158  47uF/25V  [CAP_C_3225X80]
C159  47uF/25V  [CAP_C_3225X80]
C160  47uF/25V  [CAP_C_3225X80]
C161  47uF/25V  [CAP_C_3225X80]
C162  1uF/20V  [CAP_C_1005X60]
C163  47uF/25V  [CAP_C_3225X80]
C164  47uF/25V  [CAP_C_3225X80]
C165  1uF/20V  [CAP_C_1005X60]
C166  2.2nF/10V  [CAP_C_1005X60]
C167  2.2nF/10V  [CAP_C_1005X60]
C168  2.2nF/10V  [CAP_C_1005X60]
C169  2.2nF/10V  [CAP_C_1005X60]
C170  47uF/25V  [CAP_C_3225X80]
C171  47uF/25V  [CAP_C_3225X80]
C172  1uF/20V  [CAP_C_1005X60]
C173  2.2nF/10V  [CAP_C_1005X60]
C174  2.2nF/10V  [CAP_C_1005X60]
C182  10uF/20V  [CAP_C_2012X110]
C183  10uF/20V  [CAP_C_2012X110]
D10  SS54  [DO-214AC_SMA]
D11  SS54  [DO-214AC_SMA]
D12  SS54  [DO-214AC_SMA]
D13  SS54  [DO-214AC_SMA]
D14  SS54  [DO-214AC_SMA]
D15  SS54  [DO-214AC_SMA]
D16  SS54  [DO-214AC_SMA]
D42  _LED_RED  [LED_0603]
D43  _LED_RED  [LED_0603]
JP3  DNP/0R  [RES_C_1608X60]
JP4  DNP/0R  [RES_C_1608X60]
JP5  DNP/0R  [RES_C_1608X60]
JP6  DNP/0R  [RES_C_1608X60]
JP7  DNP/0R  [RES_C_1608X60]
JP8  DNP/0R  [RES_C_1608X60]
JP9  DNP/0R  [RES_C_1608X60]
JP10  DNP/0R  [RES_C_1608X60]
JP11  DNP/0R  [RES_C_1608X60]
R217  470k  [RES_C_1005X40]
R218  47k  [RES_C_1005X40]
R219  47k  [RES_C_1005X40]
R220  470k  [RES_C_1005X40]
R221  133k  [RES_C_1005X40]
R222  470k  [RES_C_1005X40]
R223  47k  [RES_C_1005X40]
R224  47k  [RES_C_1005X40]
R225  22R  [RES_C_1005X40]
R226  1.6k  [RES_C_1005X40]
R227  DNP/10k  [RES_C_1005X40]
R228  47k  [RES_C_1005X40]
R229  10k  [RES_C_1005X40]
R230  1.6k  [RES_C_1005X40]
R231  470k  [RES_C_1005X40]
R232  470k  [RES_C_1005X40]
R233  47k  [RES_C_1005X40]
R234  47k  [RES_C_1005X40]
R235  47k  [RES_C_1005X40]
R236  47k  [RES_C_1005X40]
R237  22R  [RES_C_1005X40]
R238  22R  [RES_C_1005X40]
R239  DNP/10k  [RES_C_1005X40]
R240  DNP/10k  [RES_C_1005X40]
R241  133k  [RES_C_1005X40]
R242  47k  [RES_C_1005X40]
R243  10k  [RES_C_1005X40]
R244  10k  [RES_C_1005X40]
R245  1.6k  [RES_C_1005X40]
R246  1.6k  [RES_C_1005X40]
R247  470k  [RES_C_1005X40]
R248  47k  [RES_C_1005X40]
R249  47k  [RES_C_1005X40]
R250  22R  [RES_C_1005X40]
R251  DNP/10k  [RES_C_1005X40]
R252  DNP/10k  [RES_C_1005X40]
R253  470k  [RES_C_1005X40]
R254  47k  [RES_C_1005X40]
R255  10k  [RES_C_1005X40]
R256  47k  [RES_C_1005X40]
R257  47k  [RES_C_1005X40]
R258  22R  [RES_C_1005X40]
R259  10k  [RES_C_1005X40]
R260  133k  [RES_C_1005X40]
R261  1.6k  [RES_C_1005X40]
R262  1.6k  [RES_C_1005X40]
R263  DNP/10k  [RES_C_1005X40]
R264  470k  [RES_C_1005X40]
R265  47k  [RES_C_1005X40]
R266  47k  [RES_C_1005X40]
R267  22R  [RES_C_1005X40]
R268  10k  [RES_C_1005X40]
R269  133k  [RES_C_1005X40]
R270  1.6k  [RES_C_1005X40]
R295  1k  [RES_C_1005X40]
R646  1k  [RES_C_1005X40]
R647  1k  [RES_C_1005X40]
TP3  (no value)  [Testpoint_TH_D130H80]  (no BOM)
TP4  (no value)  [Testpoint_TH_D130H80]  (no BOM)
TP19  (no value)  [Testpoint_TH_D130H80]  (no BOM)
TP23  (no value)  [Testpoint_TH_D130H80]  (no BOM)
TP24  (no value)  [Testpoint_TH_D130H80]  (no BOM)
U23  TPS259470ARPWR  [VQFN-HR-10]
U24  TPS259470ARPWR  [VQFN-HR-10]
U25  TPS259470ARPWR  [VQFN-HR-10]
U26  TPS259470ARPWR  [VQFN-HR-10]
U27  TPS259470ARPWR  [VQFN-HR-10]
U28  TPS259470ARPWR  [VQFN-HR-10]
U29  TPS259470ARPWR  [VQFN-HR-10]
U40  TLV75518PDBVR  [SOT25]
VR2  LM1117MP-3.3/NOPB  [VREG_LM1117MP-3.3/NOPB]
VR3  LM1117MP-3.3/NOPB  [VREG_LM1117MP-3.3/NOPB]

### Nets
+1.8V: C183.1 U40.5(VOUT)
+3.3V: C158.2 C159.2 C182.1 D43.2(A) R295.2 U40.1(VIN) VR3.2(VOUT_2) VR3.4(VOUT_4)
+3.3V_MCU: C143.2 C144.2 D42.2(A) VR2.2(VOUT_2) VR2.4(VOUT_4)
+3/5V_Solenoid: C139.2 C140.2 D11.1 JP6.2 R223.2 R224.2 U24.6(OUT)
+3V_SOLENOID: JP4.1
+5V: C147.2 C148.2 C157.1 D12.1 JP7.2 R233.2 R234.2 U25.6(OUT) VR3.3(VIN)
+5V_ADT2: C151.2 C165.2 C172.2 JP5.1 JP7.1 JP10.1 JP11.1 R231.2 R253.2 R264.2 TP23.1 U25.5(IN) U28.5(IN) U29.5(IN)
+5V_HD4: C170.2 C171.2 D16.1 JP11.2 R265.2 R266.2 U29.6(OUT)
+5V_MCU: C134.2 C135.2 C142.1 D10.1 JP3.2 R218.2 R219.2 R227.2 R239.2 R240.2 R251.2 R252.2 R263.2 U23.6(OUT) VR2.3(VIN)
+5V_TEC: C163.2 C164.2 D15.1 JP10.2 R256.2 R257.2 U28.6(OUT)
+5V_USB_ADT2: C136.2 JP3.1 R217.2 TP3.1 U23.5(IN)
+12V_ADT2: C152.2 C162.2 JP8.1 JP9.1 R232.2 R247.2 TP19.1 U26.5(IN) U27.5(IN)
+12V_Laser: C160.2 C161.2 D14.1 JP9.2 R248.2 R249.2 U27.6(OUT)
+12V_Photo: C149.2 C150.2 D13.1 JP8.2 R235.2 R236.2 U26.6(OUT)
GND: C134.1 C135.1 C136.1 C137.1 C138.1 C139.1 C140.1 C141.1 C142.2 C143.1 C144.1 C145.1 C146.1 C147.1 C148.1 C149.1 C150.1 C151.1 C152.1 C153.1 C154.1 C155.1 C156.1 C157.2 C158.1 C159.1 C160.1 C161.1 C162.1 C163.1 C164.1 C165.1 C166.1 C167.1 C168.1 C169.1 C170.1 C171.1 C172.1 C173.1 C174.1 C182.2 C183.2 D10.2 D11.2 D12.2 D13.2 D14.2 D15.2 D16.2 R221.1 R226.1 R228.1 R229.2 R230.1 R241.1 R242.1 R243.2 R244.2 R245.1 R246.1 R254.1 R255.2 R259.2 R260.1 R261.1 R262.1 R268.2 R269.1 R270.1 R646.1 R647.1 TP4.1 TP24.1 U23.8 U24.8 U25.8 U26.8 U27.8 U28.8 U29.8 U40.2(GND) VR2.1(GND) VR3.1(GND)
eFUSE_ILIM_3/5V_Solenoid: R230.2 U24.9 ; off-sheet eFUSE_ILIM_3/5V_Solenoid
eFUSE_ILIM_5V: R245.2 U25.9 ; off-sheet eFUSE_ILIM_5V
eFUSE_ILIM_5V_HD4: R270.2 U29.9 ; off-sheet eFUSE_ILIM_5V_HD4
eFUSE_ILIM_5V_MCU: R226.2 U23.9 ; off-sheet eFUSE_ILIM_5V_MCU
eFUSE_ILIM_5V_TEC: R262.2 U28.9 ; off-sheet eFUSE_ILIM_5V_TEC
eFUSE_ILIM_12V_Laser: R261.2 U27.9 ; off-sheet eFUSE_ILIM_12V_Laser
eFUSE_ILIM_12V_Photo: R246.2 U26.9 ; off-sheet eFUSE_ILIM_12V_Photo
POW_ONOFF_5V: R237.2 ; off-sheet POW_ONOFF_5V
POW_ONOFF_HD4: R267.2 ; off-sheet POW_ONOFF_HD4
POW_ONOFF_Laser: R250.2 ; off-sheet POW_ONOFF_Laser
POW_ONOFF_Photo: R238.2 ; off-sheet POW_ONOFF_Photo
POW_ONOFF_Solenoid: R225.2 ; off-sheet POW_ONOFF_Solenoid
POW_ONOFF_TEC: R258.2 ; off-sheet POW_ONOFF_TEC
NetC137_2: C137.2 U23.10
NetC138_2: C138.2 U23.7
NetC141_2: C141.2 JP4.2 JP5.2 JP6.1 R222.2 U24.5(IN)
NetC145_2: C145.2 U24.10
NetC146_2: C146.2 U24.7
NetC153_2: C153.2 U25.10
NetC154_2: C154.2 U25.7
NetC155_2: C155.2 U26.10
NetC156_2: C156.2 U26.7
NetC166_2: C166.2 U27.10
NetC167_2: C167.2 U27.7
NetC168_2: C168.2 U28.10
NetC169_2: C169.2 U28.7
NetC173_2: C173.2 U29.10
NetC174_2: C174.2 U29.7
NetD42_1: D42.1(K) R646.2
NetD43_1: D43.1(K) R647.2
NetR217_1: R217.1 R220.2 U23.1(EN/UVLO)
NetR218_1: R218.1 U23.3(PG/AUXOFF)
NetR219_1: R219.1 U23.4(PGTH/~{FLT})
NetR220_1: R220.1 R221.2 U23.2(OVLO/OVCSEL)
NetR222_1: R222.1 R228.2 U24.2(OVLO/OVCSEL)
NetR223_1: R223.1 U24.3(PG/AUXOFF)
NetR224_1: R224.1 U24.4(PGTH/~{FLT})
NetR225_1: R225.1 R227.1 R229.1 U24.1(EN/UVLO)
NetR231_1: R231.1 R241.2 U25.2(OVLO/OVCSEL)
NetR232_1: R232.1 R242.2 U26.2(OVLO/OVCSEL)
NetR233_1: R233.1 U25.3(PG/AUXOFF)
NetR234_1: R234.1 U25.4(PGTH/~{FLT})
NetR235_1: R235.1 U26.3(PG/AUXOFF)
NetR236_1: R236.1 U26.4(PGTH/~{FLT})
NetR237_1: R237.1 R239.1 R243.1 U25.1(EN/UVLO)
NetR238_1: R238.1 R240.1 R244.1 U26.1(EN/UVLO)
NetR247_1: R247.1 R254.2 U27.2(OVLO/OVCSEL)
NetR248_1: R248.1 U27.3(PG/AUXOFF)
NetR249_1: R249.1 U27.4(PGTH/~{FLT})
NetR250_1: R250.1 R251.1 R255.1 U27.1(EN/UVLO)
NetR252_1: R252.1 R258.1 R259.1 U28.1(EN/UVLO)
NetR253_1: R253.1 R260.2 U28.2(OVLO/OVCSEL)
NetR256_1: R256.1 U28.3(PG/AUXOFF)
NetR257_1: R257.1 U28.4(PGTH/~{FLT})
NetR263_1: R263.1 R267.1 R268.1 U29.1(EN/UVLO)
NetR264_1: R264.1 R269.2 U29.2(OVLO/OVCSEL)
NetR265_1: R265.1 U29.3(PG/AUXOFF)
NetR266_1: R266.1 U29.4(PGTH/~{FLT})
NetR295_1: R295.1 U40.3(EN)

Not connected (* = marked no-connect by the designer): U40 4(NC)*

### Notes on the sheet
- Undervoltage Protector:
- Overvoltage Protector: 1.2*(133+470)/133=5.44V
- Slew Rate: 2000/2200=0.91V/ms
- I-LIM: 3334/1600=2.08A
- 3V 2A
- Overvoltage Protector: 1.2*(47+470)/47=13.2V
- Undervoltage Protector: NONE
- Project:
- Sub-system:
- Design by:
- Sheet title:
- Sheet
- of
- Checked by:
- Approved by:
- Revision:
- Document No:
- Size:
- Date:
- A3

### Library data of the parts
C134 C135 C139 C140 C142-C144 C147-C150 C157-C161 C163 C164 C170 C171 C182 C183 = _CAP_C_High_2: CAP CHIP High Value
C136-C138 C141 C145 C146 C151-C156 C162 C165-C169 C172-C174 = _CAP_C_2: CAP CHIP
D10-D16 = SS54: DIODE SCHOTTKY 60V 3A DO214AA
JP3-JP11 = JUMPER_1_1
R217-R270 R295 R646 R647 = _RES_B_2: RES
TP3 TP4 TP19 TP23 TP24 = Test Point: Solder: NF
U40 = IC_POWER_AP7347DQ
VR2 VR3 = LM1117MP-3.3/NOPB: as VR1 on sheet 05_POWER_SAMA7.Doc; SnapEDA_Link: https://www.snapeda.com/parts/LM1117MP-3.3/NOPB/Texas+Instruments/view-part/?ref=snap; Package: SOT-223-4 Texas Instruments; Value: *; MP: LM1117MP-3.3/NOPB; Check_prices: https://www.snapeda.com/parts/LM1117MP-3.3/NOPB/Texas+Instruments/view-part/?ref=eda

## Sheet 05_POWER_MCU_2.SchDoc
size 420 x 297 mm; SheetNumber: 9; SheetTotal: 29
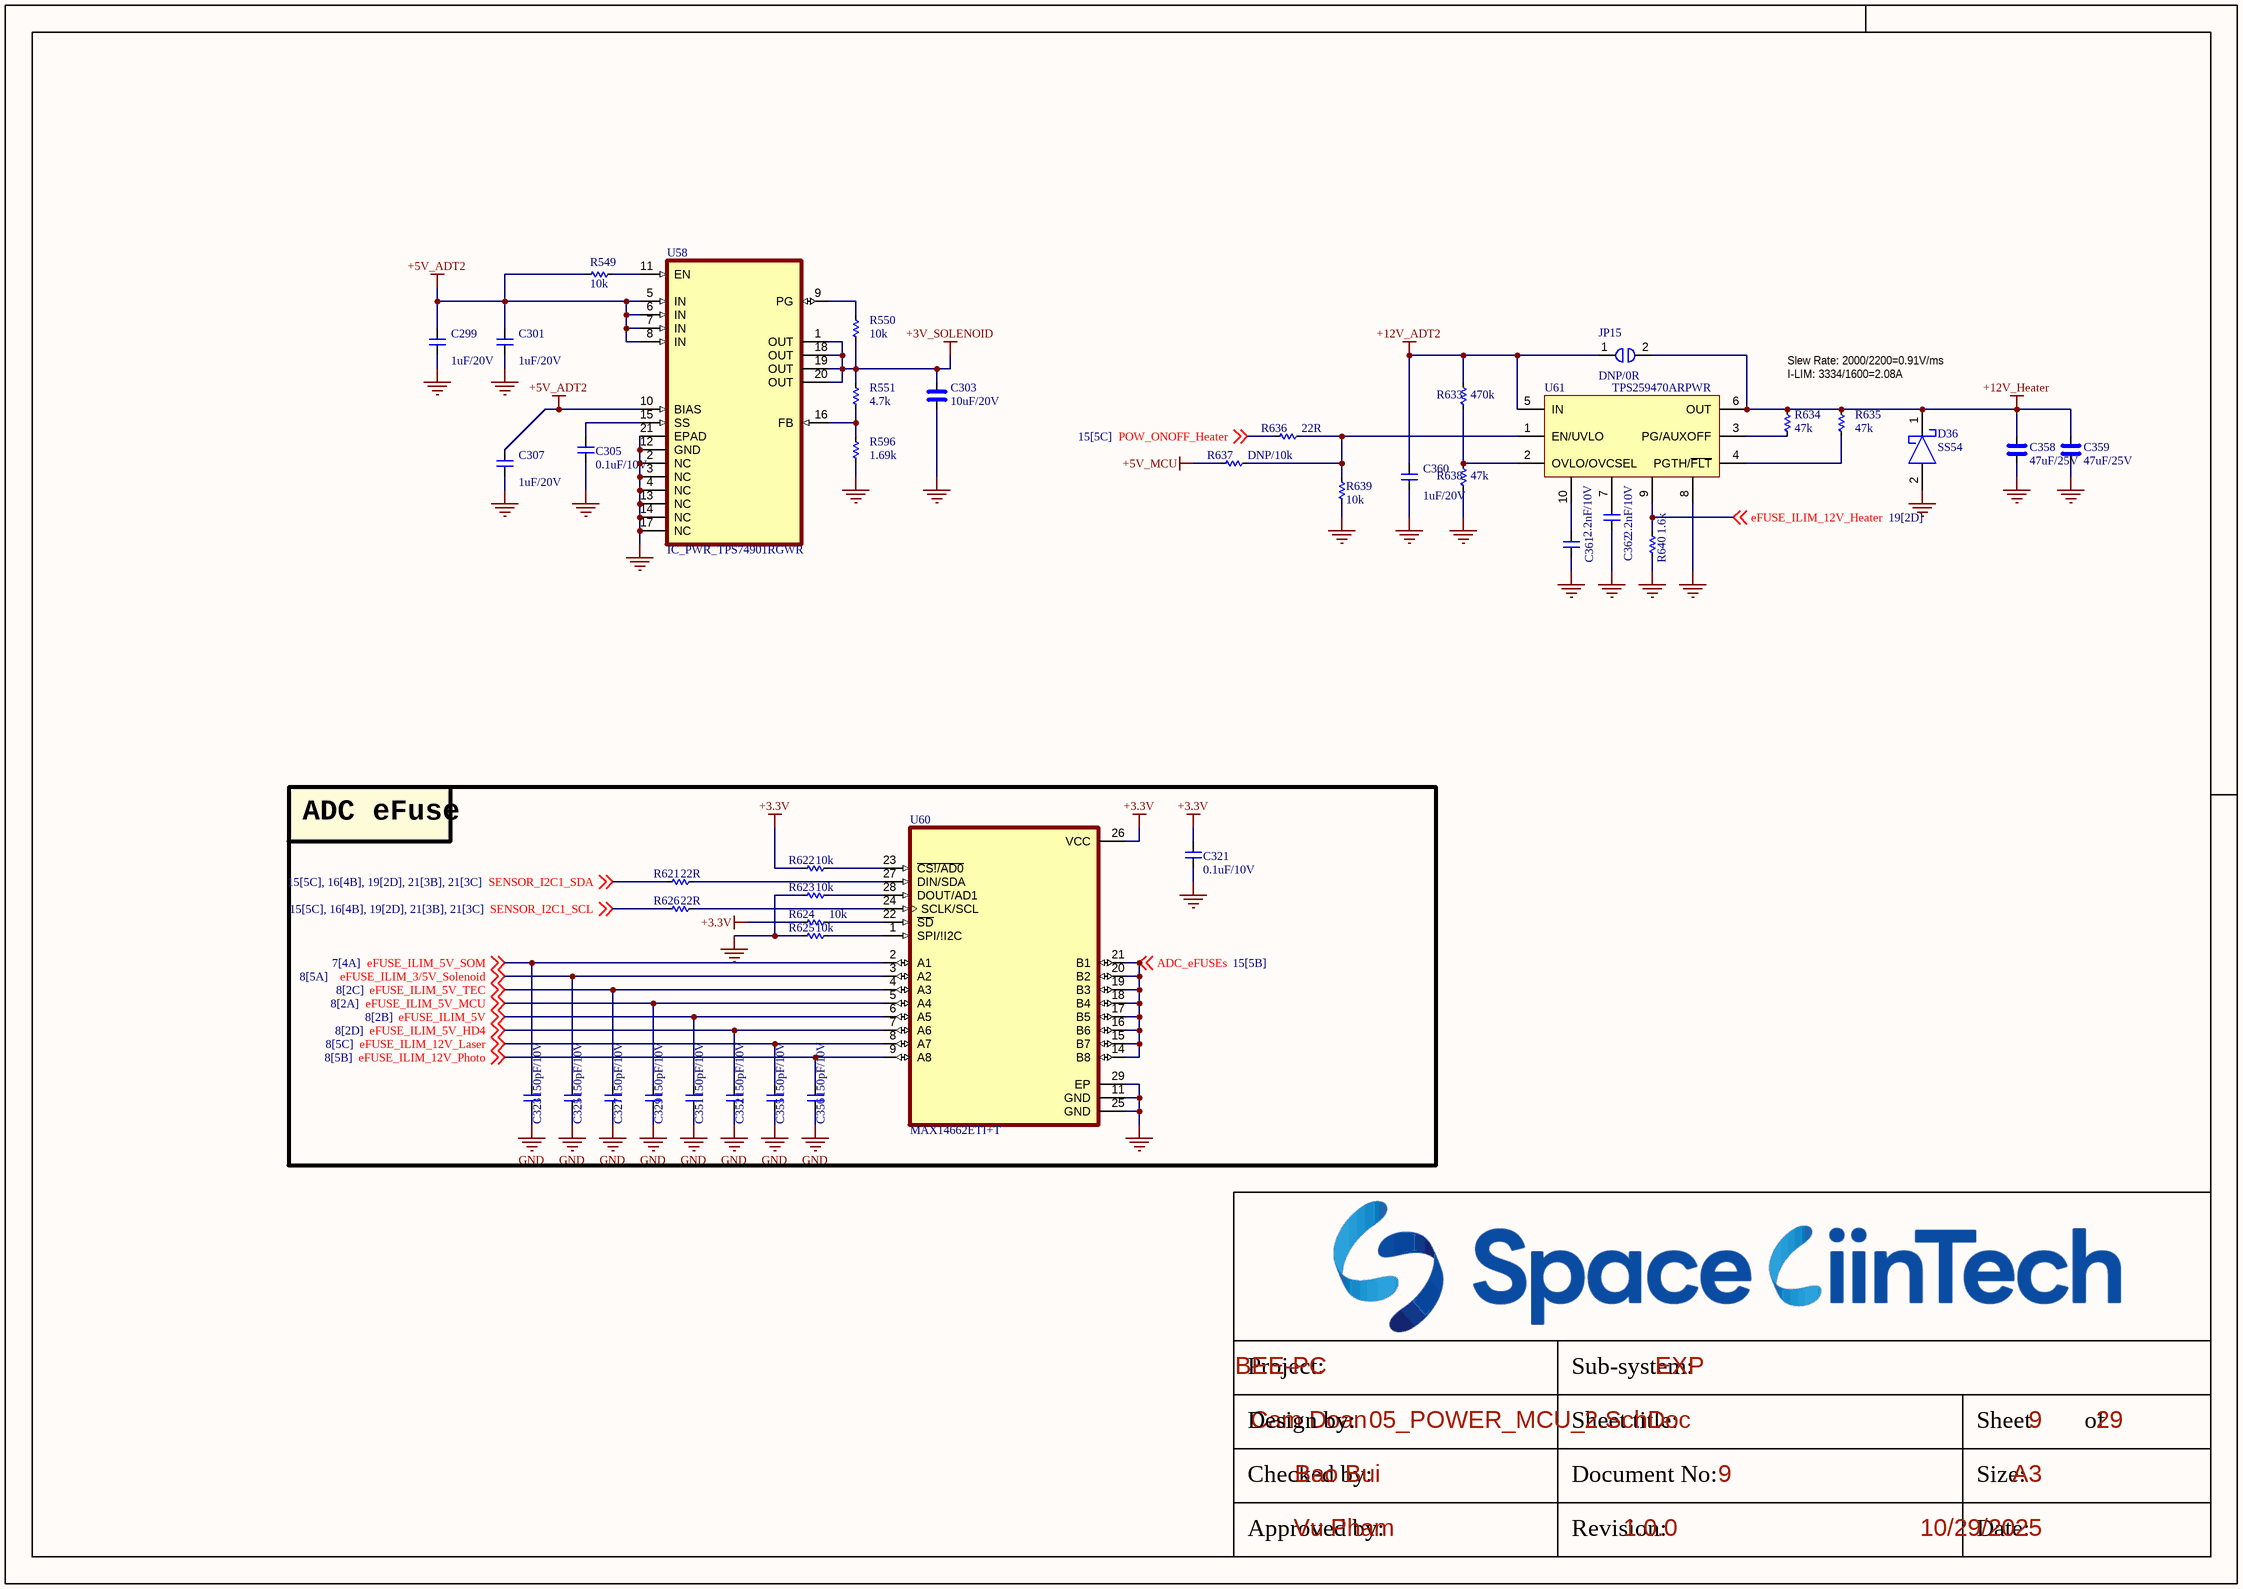
[diagram p7: 05_POWER_MCU_2.SchDoc]

### Parts
C299  1uF/20V  [CAP_C_1005X60]
C301  1uF/20V  [CAP_C_1005X60]
C303  10uF/20V  [CAP_C_2012X110]
C305  0.1uF/10V  [CAP_C_1005X60]
C307  1uF/20V  [CAP_C_1005X60]
C321  0.1uF/10V  [CAP_C_1005X60]
C323  150pF/10V  [CAP_C_1005X60]
C325  150pF/10V  [CAP_C_1005X60]
C327  150pF/10V  [CAP_C_1005X60]
C329  150pF/10V  [CAP_C_1005X60]
C351  150pF/10V  [CAP_C_1005X60]
C352  150pF/10V  [CAP_C_1005X60]
C355  150pF/10V  [CAP_C_1005X60]
C356  150pF/10V  [CAP_C_1005X60]
C358  47uF/25V  [CAP_C_3225X80]
C359  47uF/25V  [CAP_C_3225X80]
C360  1uF/20V  [CAP_C_1005X60]
C361  2.2nF/10V  [CAP_C_1005X60]
C362  2.2nF/10V  [CAP_C_1005X60]
D36  SS54  [DO-214AC_SMA]
JP15  DNP/0R  [RES_C_1608X60]
R549  10k  [RES_C_1005X40]
R550  10k  [RES_C_1005X40]
R551  4.7k  [RES_C_1005X40]
R596  1.69k  [RES_C_1005X40]
R621  22R  [RES_C_1005X40]
R622  10k  [RES_C_1005X40]
R623  10k  [RES_C_1005X40]
R624  10k  [RES_C_1005X40]
R625  10k  [RES_C_1005X40]
R626  22R  [RES_C_1005X40]
R633  470k  [RES_C_1005X40]
R634  47k  [RES_C_1005X40]
R635  47k  [RES_C_1005X40]
R636  22R  [RES_C_1005X40]
R637  DNP/10k  [RES_C_1005X40]
R638  47k  [RES_C_1005X40]
R639  10k  [RES_C_1005X40]
R640  1.6k  [RES_C_1005X40]
U58  IC_PWR_TPS74901RGWR  [QFN65P500X500X100-21N]
U60  MAX14662ETI+T  [QFN40P400X400X80-29N]
U61  TPS259470ARPWR  [VQFN-HR-10]

### Blocks framed on the sheet
ADC eFuse: C321 C323 C325 C327 C329 C351 C352 C355 C356 R621-R626 U60

### Nets
+3.3V: C321.2 R622.1 R624.1 U60.26(VCC)
+3V_SOLENOID: C303.1 R550.1 R551.2 U58.1(OUT) U58.18(OUT) U58.19(OUT) U58.20(OUT)
+5V_ADT2: C299.2 C301.2 C307.2 R549.2 U58.5(IN) U58.6(IN) U58.7(IN) U58.8(IN) U58.10(BIAS)
+5V_MCU: R637.2
+12V_ADT2: C360.2 JP15.1 R633.2 U61.5(IN)
+12V_Heater: C358.2 C359.2 D36.1 JP15.2 R634.2 R635.2 U61.6(OUT)
GND: C299.1 C301.1 C303.2 C305.1 C307.1 C321.1 C323.1 C325.1 C327.1 C329.1 C351.1 C352.1 C355.1 C356.1 C358.1 C359.1 C360.1 C361.1 C362.1 D36.2 R596.1 R623.1 R625.1 R638.1 R639.2 R640.1 U58.2(NC) U58.3(NC) U58.4(NC) U58.12(GND) U58.13(NC) U58.14(NC) U58.17(NC) U58.21(EPAD) U60.11(GND) U60.25(GND) U60.29(EP) U61.8
ADC_eFUSEs: U60.14(B8) U60.15(B7) U60.16(B6) U60.17(B5) U60.18(B4) U60.19(B3) U60.20(B2) U60.21(B1) ; off-sheet ADC_eFUSEs
eFUSE_ILIM_3/5V_Solenoid: C325.2 U60.3(A2) ; off-sheet eFUSE_ILIM_3/5V_Solenoid
eFUSE_ILIM_5V: C351.2 U60.6(A5) ; off-sheet eFUSE_ILIM_5V
eFUSE_ILIM_5V_HD4: C352.2 U60.7(A6) ; off-sheet eFUSE_ILIM_5V_HD4
eFUSE_ILIM_5V_MCU: C329.2 U60.5(A4) ; off-sheet eFUSE_ILIM_5V_MCU
eFUSE_ILIM_5V_SOM: C323.2 U60.2(A1) ; off-sheet eFUSE_ILIM_5V_SOM
eFUSE_ILIM_5V_TEC: C327.2 U60.4(A3) ; off-sheet eFUSE_ILIM_5V_TEC
eFUSE_ILIM_12V_Heater: R640.2 U61.9 ; off-sheet eFUSE_ILIM_12V_Heater
eFUSE_ILIM_12V_Laser: C355.2 U60.8(A7) ; off-sheet eFUSE_ILIM_12V_Laser
eFUSE_ILIM_12V_Photo: C356.2 U60.9(A8) ; off-sheet eFUSE_ILIM_12V_Photo
POW_ONOFF_Heater: R636.2 ; off-sheet POW_ONOFF_Heater
SENSOR_I2C1_SCL: R626.1 ; off-sheet SENSOR_I2C1_SCL
SENSOR_I2C1_SDA: R621.1 ; off-sheet SENSOR_I2C1_SDA
NetC305_2: C305.2 U58.15(SS)
NetC361_2: C361.2 U61.10
NetC362_2: C362.2 U61.7
NetR549_1: R549.1 U58.11(EN)
NetR550_2: R550.2 U58.9(PG)
NetR551_1: R551.1 R596.2 U58.16(FB)
NetR621_2: R621.2 U60.27(DIN/SDA)
NetR622_2: R622.2 U60.23(~{CS!/AD0})
NetR623_2: R623.2 U60.28(DOUT/AD1)
NetR624_2: R624.2 U60.22(~{SD})
NetR625_2: R625.2 U60.1(SPI/!I2C)
NetR626_2: R626.2 U60.24(SCLK/SCL)
NetR633_1: R633.1 R638.2 U61.2(OVLO/OVCSEL)
NetR634_1: R634.1 U61.3(PG/AUXOFF)
NetR635_1: R635.1 U61.4(PGTH/~{FLT})
NetR636_1: R636.1 R637.1 R639.1 U61.1(EN/UVLO)

### Notes on the sheet
- Slew Rate: 2000/2200=0.91V/ms
- I-LIM: 3334/1600=2.08A
- Project:
- Sub-system:
- Design by:
- Sheet title:
- Sheet
- of
- Checked by:
- Approved by:
- Revision:
- Document No:
- Size:
- Date:
- A3

### Library data of the parts
C299 C301 C305 C307 C321 C323 C325 C327 C329 C351 C352 C355 C356 C360-C362 = _CAP_C_2: CAP CHIP
C303 C358 C359 = _CAP_C_High_2: CAP CHIP High Value
D36 = SS54: DIODE SCHOTTKY 60V 3A DO214AA
JP15 = JUMPER_1_1
R549-R551 R596 R621-R626 R633-R640 = _RES_B_2: RES
U58 = IC_PWR_TPS74901RGWR: 3-A, low-VIN (0.8-V), adjustable ultra-low-dropout voltage regulator with power good & enable 20-VQFN -40 to 125; MF: Texas Instruments; Price: None; Check_prices: https://www.snapeda.com/parts/TPS74901RGWR/Texas%20Instruments/view-part/1101342/?ref=eda; SnapEDA_Link: https://www.snapeda.com/parts/TPS74901RGWR/Texas%20Instruments/view-part/1101342/?ref=snap; Package: VQFN-20 Texas Instruments; Purchase-URL: https://pricing.snapeda.com/search/part/TPS74901RGWR/?ref=eda; Availability: Good; MP: TPS74901RGWR; Value: *
U60 = IC_SW_MAX14662ETI+T: 8 Circuit IC Switch 1:1 1Ohm 28-TQFN _4x4_; MF: Maxim Integrated; Package: TQFN-28 Maxim; Value: *; Price: None; MP: MAX14662ETI+T; SnapEDA_Link: https://www.snapeda.com/parts/MAX14662ETI%2BT/Maxim%20Integrated/view-part/546683/?ref=snap; Availability: Unavailable

## Sheet 06_SOM_USB_CARD.SchDoc
size 420 x 297 mm; SheetNumber: 10; SheetTotal: 29
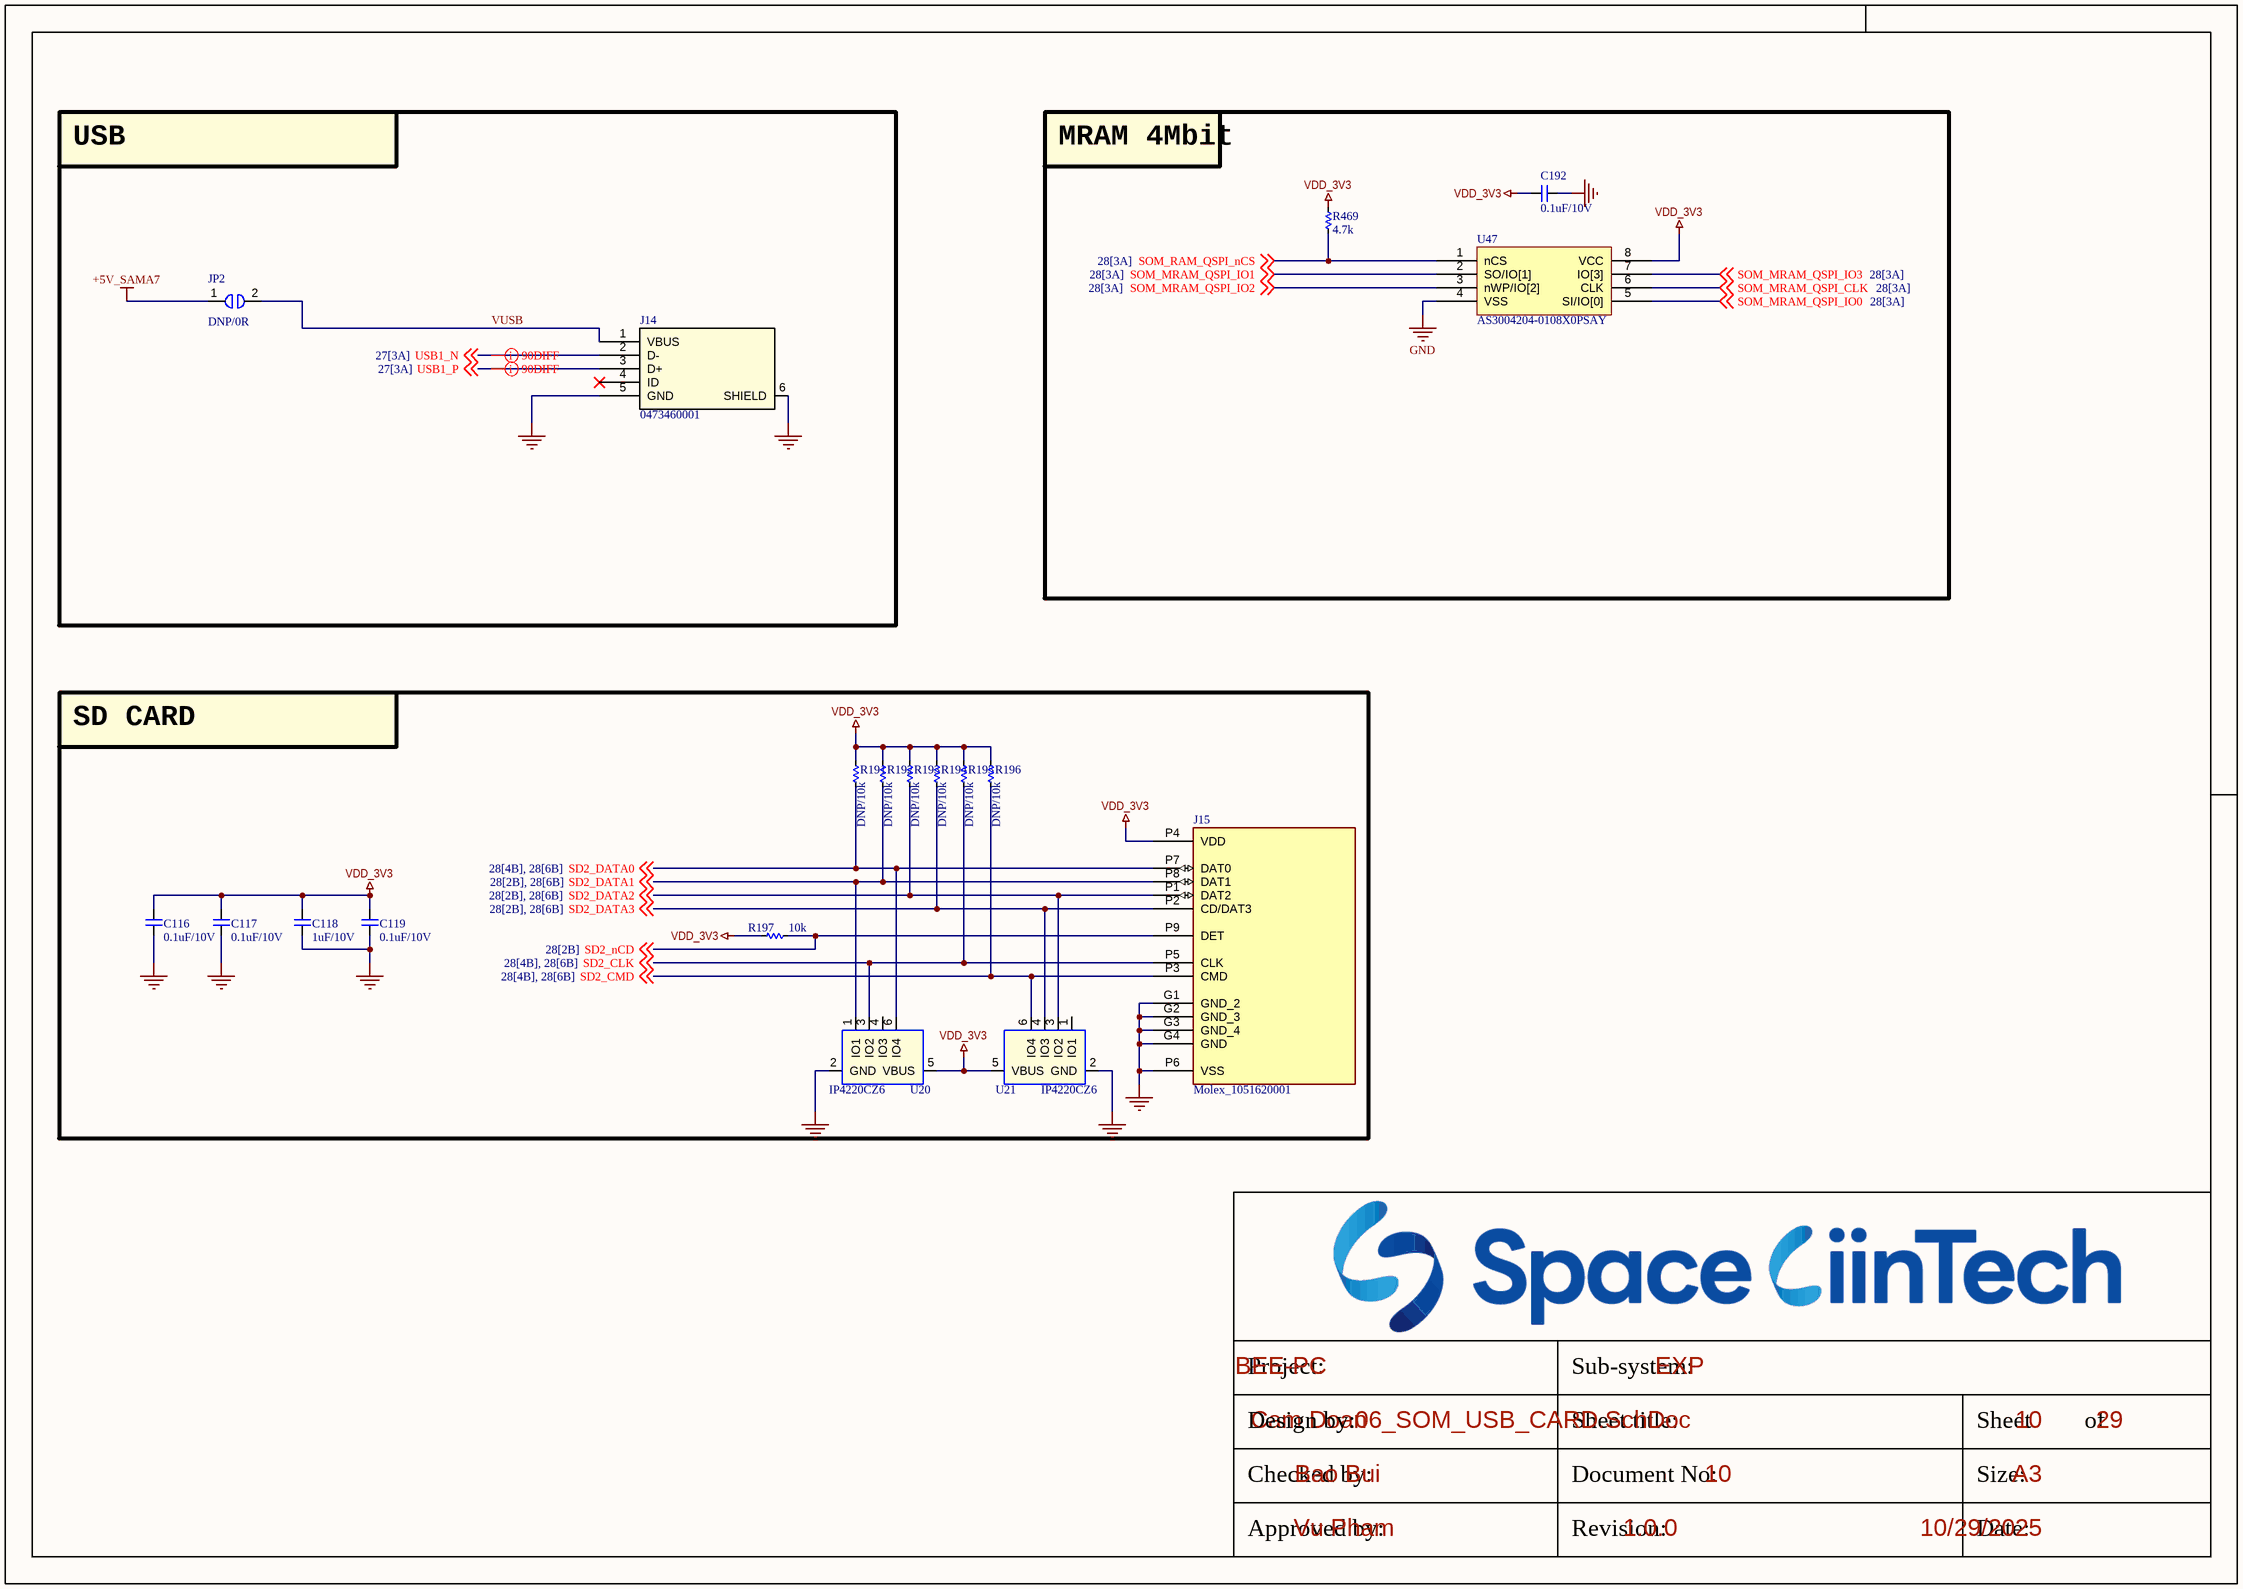
[diagram p8: 06_SOM_USB_CARD.SchDoc]

### Parts
C116  0.1uF/10V  [CAP_C_1005X60]
C117  0.1uF/10V  [CAP_C_1005X60]
C118  1uF/10V  [CAP_C_1005X60]
C119  0.1uF/10V  [CAP_C_1005X60]
C192  0.1uF/10V  [CAP_C_1005X60]
J14  0473460001  [47346-0001_MOL]
J15  Molex_1051620001  [Molex_1051620001]
JP2  DNP/0R  [RES_C_1608X60]
R191  DNP/10k  [RES_C_1005X40]
R192  DNP/10k  [RES_C_1005X40]
R193  DNP/10k  [RES_C_1005X40]
R194  DNP/10k  [RES_C_1005X40]
R195  DNP/10k  [RES_C_1005X40]
R196  DNP/10k  [RES_C_1005X40]
R197  10k  [RES_C_1005X40]
R469  4.7k  [RES_C_1005X40]
U20  IP4220CZ6  [SOT95P280X145-6N]
U21  IP4220CZ6  [SOT95P280X145-6N]
U47  AS3004204-0108X0PSAY  [SOIC127P790X216-8]

### Blocks framed on the sheet
USB: J14 JP2
MRAM 4Mbit: C192 R469 U47
SD CARD: C116-C119 J15 R191-R197 U20 U21

### Nets
+5V_SAMA7: JP2.1
GND: C116.1 C117.1 C118.1 C119.1 C192.1 J14.5(GND) J14.6(SHIELD) J15.G1(GND_2) J15.G2(GND_3) J15.G3(GND_4) J15.G4(GND) J15.P6(VSS) U20.2(GND) U21.2(GND) U47.4(VSS)
VDD_3V3: C116.2 C117.2 C118.2 C119.2 C192.2 J15.P4(VDD) R191.2 R192.2 R193.2 R194.2 R195.2 R196.2 R197.1 R469.2 U20.5(VBUS) U21.5(VBUS) U47.8(VCC)
SD2_CLK: J15.P5(CLK) R195.1 U20.3(IO2) ; off-sheet SD2_CLK
SD2_CMD: J15.P3(CMD) R196.1 U21.6(IO4) ; off-sheet SD2_CMD
SD2_DATA0: J15.P7(DAT0) R191.1 U20.6(IO4) ; off-sheet SD2_DATA0
SD2_DATA1: J15.P8(DAT1) R192.1 U20.1(IO1) ; off-sheet SD2_DATA1
SD2_DATA2: J15.P1(DAT2) R193.1 U21.3(IO2) ; off-sheet SD2_DATA2
SD2_DATA3: J15.P2(CD/DAT3) R194.1 U21.4(IO3) ; off-sheet SD2_DATA3
SD2_nCD: J15.P9(DET) R197.2 ; off-sheet SD2_nCD
SOM_MRAM_QSPI_CLK: U47.6(CLK) ; off-sheet SOM_MRAM_QSPI_CLK
SOM_MRAM_QSPI_IO0: U47.5(SI/IO[0]) ; off-sheet SOM_MRAM_QSPI_IO0
SOM_MRAM_QSPI_IO1: U47.2(SO/IO[1]) ; off-sheet SOM_MRAM_QSPI_IO1
SOM_MRAM_QSPI_IO2: U47.3(nWP/IO[2]) ; off-sheet SOM_MRAM_QSPI_IO2
SOM_MRAM_QSPI_IO3: U47.7(IO[3]) ; off-sheet SOM_MRAM_QSPI_IO3
SOM_RAM_QSPI_nCS: R469.1 U47.1(nCS) ; off-sheet SOM_RAM_QSPI_nCS
USB1_N: J14.2(D-) ; off-sheet USB1_N
USB1_P: J14.3(D+) ; off-sheet USB1_P
VUSB: J14.1(VBUS) JP2.2

Not connected (* = marked no-connect by the designer): J14 4(ID)*; U20 4(IO3); U21 1(IO1)

### Layout directives
differential pair; differential pair class DIFF90: USB1_N, USB1_P

### Notes on the sheet
- Project:
- Sub-system:
- Design by:
- Sheet title:
- Sheet
- of
- Checked by:
- Approved by:
- Revision:
- Document No:
- Size:
- Date:
- A3

### Library data of the parts
C116-C119 C192 = _CAP_C_2: CAP CHIP
J14 = USB_micro: No Description Available; Mfr_Name: Molex Connector Corporation; RefDes: RefDes; Type: Type
J15 = Molex_1051620001: 9 (8 + 1) Position Card Connector Secure Digital - microSDâ„¢ Surface Mount, Right Angle Gold; MF: Molex; SnapEDA_Link: https://www.snapeda.com/parts/1051620001/Molex/view-part/?ref=snap; Package: None; Value: *; MP: 1051620001; Check_prices: https://www.snapeda.com/parts/1051620001/Molex/view-part/?ref=eda
JP2 = JUMPER_1_1
R191-R197 R469 = _RES_B_2: RES
U20 U21 = IP4220CZ6_0: P/N: 132D42200S; PCB Footprint: SOT23-6L; CLABCONF0: =SB-UCMIMX93
U47 = IC_RAM_AS3004204-0108X0PSAY

## Sheet 06_SOM_Console.SchDoc
size 420 x 297 mm; SheetNumber: 11; SheetTotal: 29
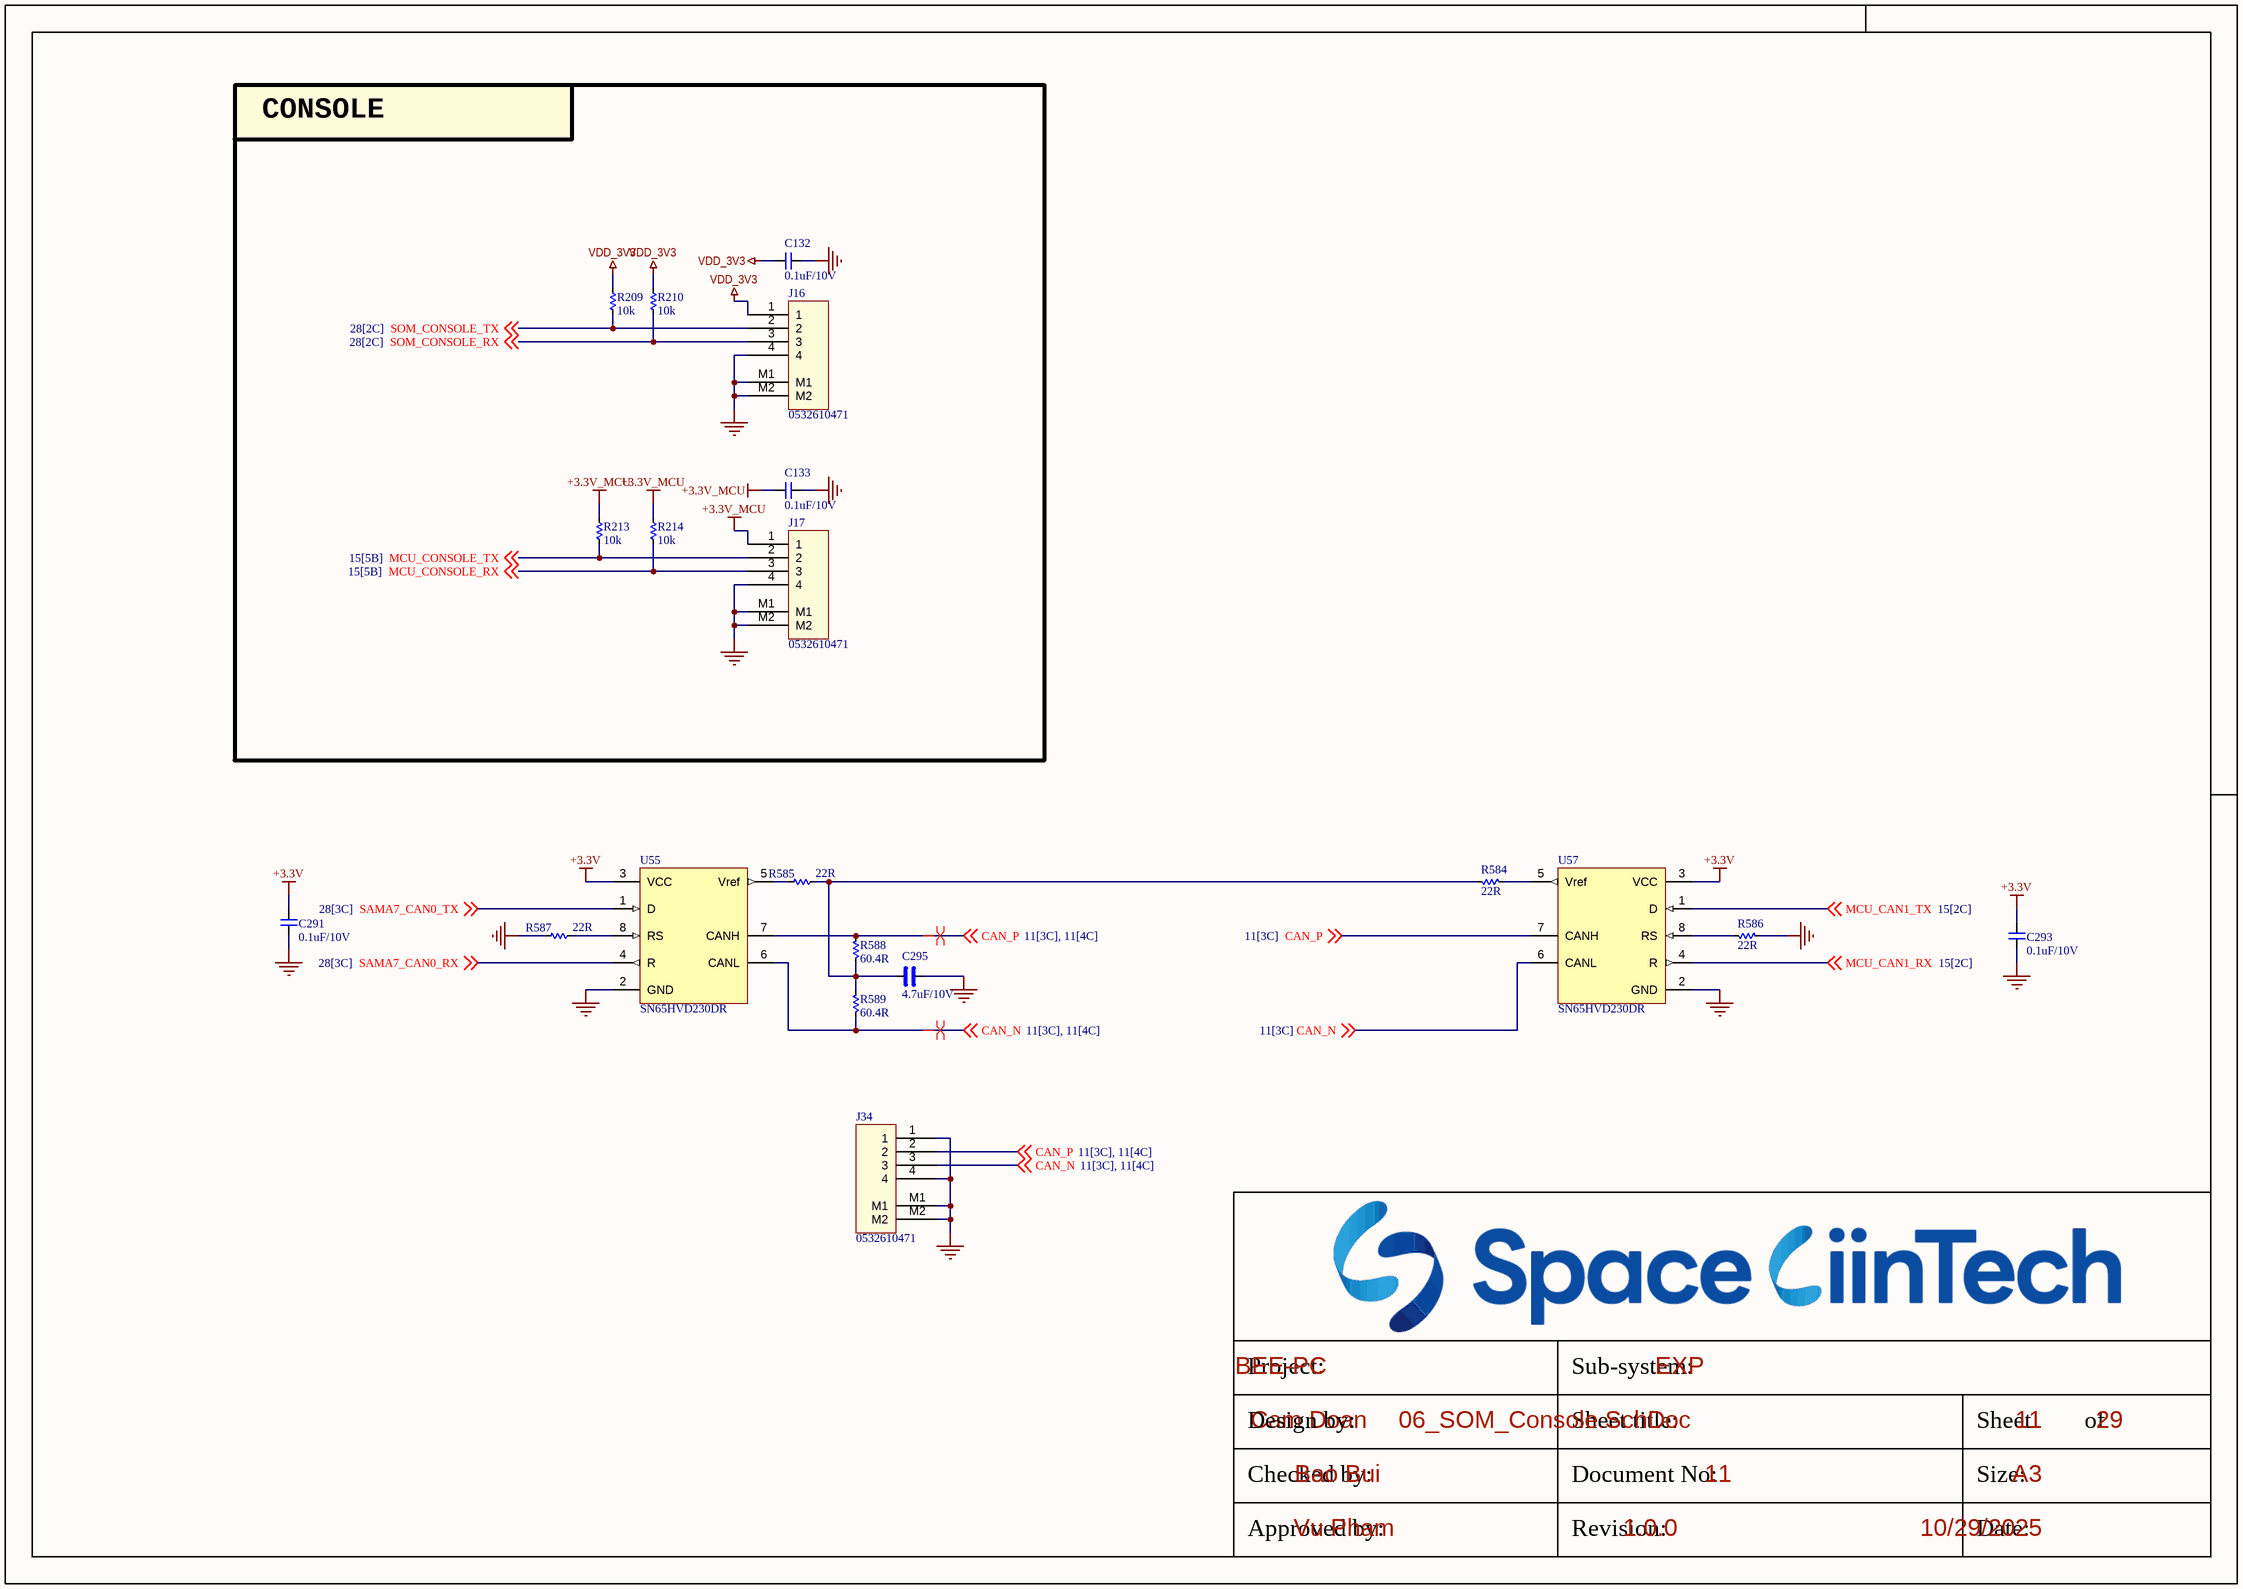
[diagram p9: 06_SOM_Console.SchDoc]

### Parts
C132  0.1uF/10V  [CAP_C_1005X60]
C133  0.1uF/10V  [CAP_C_1005X60]
C291  0.1uF/10V  [CAP_C_1005X60]
C293  0.1uF/10V  [CAP_C_1005X60]
C295  4.7uF/10V  [CAP_C_1005X60]
J16  0532610471  [MOLEX_0532610471]
J17  0532610471  [MOLEX_0532610471]
J34  0532610471  [MOLEX_0532610471]
R209  10k  [RES_C_1005X40]
R210  10k  [RES_C_1005X40]
R213  10k  [RES_C_1005X40]
R214  10k  [RES_C_1005X40]
R584  22R  [RES_C_1005X40]
R585  22R  [RES_C_1005X40]
R586  22R  [RES_C_1005X40]
R587  22R  [RES_C_1005X40]
R588  60.4R  [RES_C_1005X40]
R589  60.4R  [RES_C_1005X40]
U55  SN65HVD230DR  [SOIC127P602X173-8N]
U57  SN65HVD230DR  [SOIC127P602X173-8N]

### Blocks framed on the sheet
CONSOLE: C132 C133 J16 J17 R209 R210 R213 R214

### Nets
+3.3V: C291.2 C293.2 U55.3(VCC) U57.3(VCC)
+3.3V_MCU: C133.2 J17.1 R213.2 R214.2
GND: C132.1 C133.1 C291.1 C293.1 C295.1 J16.4 J16.M1 J16.M2 J17.4 J17.M1 J17.M2 J34.1 J34.4 J34.M1 J34.M2 R586.2 R587.2 U55.2(GND) U57.2(GND)
VDD_3V3: C132.2 J16.1 R209.2 R210.2
CAN_N: J34.3 R589.1 U55.6(CANL) U57.6(CANL) ; off-sheet CAN_N
CAN_P: J34.2 R588.2 U55.7(CANH) U57.7(CANH) ; off-sheet CAN_P
MCU_CAN1_RX: U57.4(R) ; off-sheet MCU_CAN1_RX
MCU_CAN1_TX: U57.1(D) ; off-sheet MCU_CAN1_TX
MCU_CONSOLE_RX: J17.3 R214.1 ; off-sheet MCU_CONSOLE_RX
MCU_CONSOLE_TX: J17.2 R213.1 ; off-sheet MCU_CONSOLE_TX
SAMA7_CAN0_RX: U55.4(R) ; off-sheet SAMA7_CAN0_RX
SAMA7_CAN0_TX: U55.1(D) ; off-sheet SAMA7_CAN0_TX
SOM_CONSOLE_RX: J16.3 R210.1 ; off-sheet SOM_CONSOLE_RX
SOM_CONSOLE_TX: J16.2 R209.1 ; off-sheet SOM_CONSOLE_TX
NetC295_2: C295.2 R584.1 R585.1 R588.1 R589.2
NetR584_2: R584.2 U57.5(Vref)
NetR585_2: R585.2 U55.5(Vref)
NetR586_1: R586.1 U57.8(RS)
NetR587_1: R587.1 U55.8(RS)

### Layout directives
differential pair; differential pair class DIFF: CAN_N, CAN_P

### Notes on the sheet
- Project:
- Sub-system:
- Design by:
- Sheet title:
- Sheet
- of
- Checked by:
- Approved by:
- Revision:
- Document No:
- Size:
- Date:
- A3

### Library data of the parts
C132 C133 C291 C293 = _CAP_C_2: CAP CHIP
C295 = _CAP_C_High_2: CAP CHIP High Value
J16 J17 J34 = Header 4x1_2M
R209 R210 R213 R214 R584-R589 = _RES_B_2: RES
U55 U57 = IC_CAN_SN65HVD230DR: IC TRANSCEIVER HALF 1/1 8SOIC

## Sheet 06_SOM_CAM.SchDoc
size 420 x 297 mm; SheetNumber: 12; SheetTotal: 28
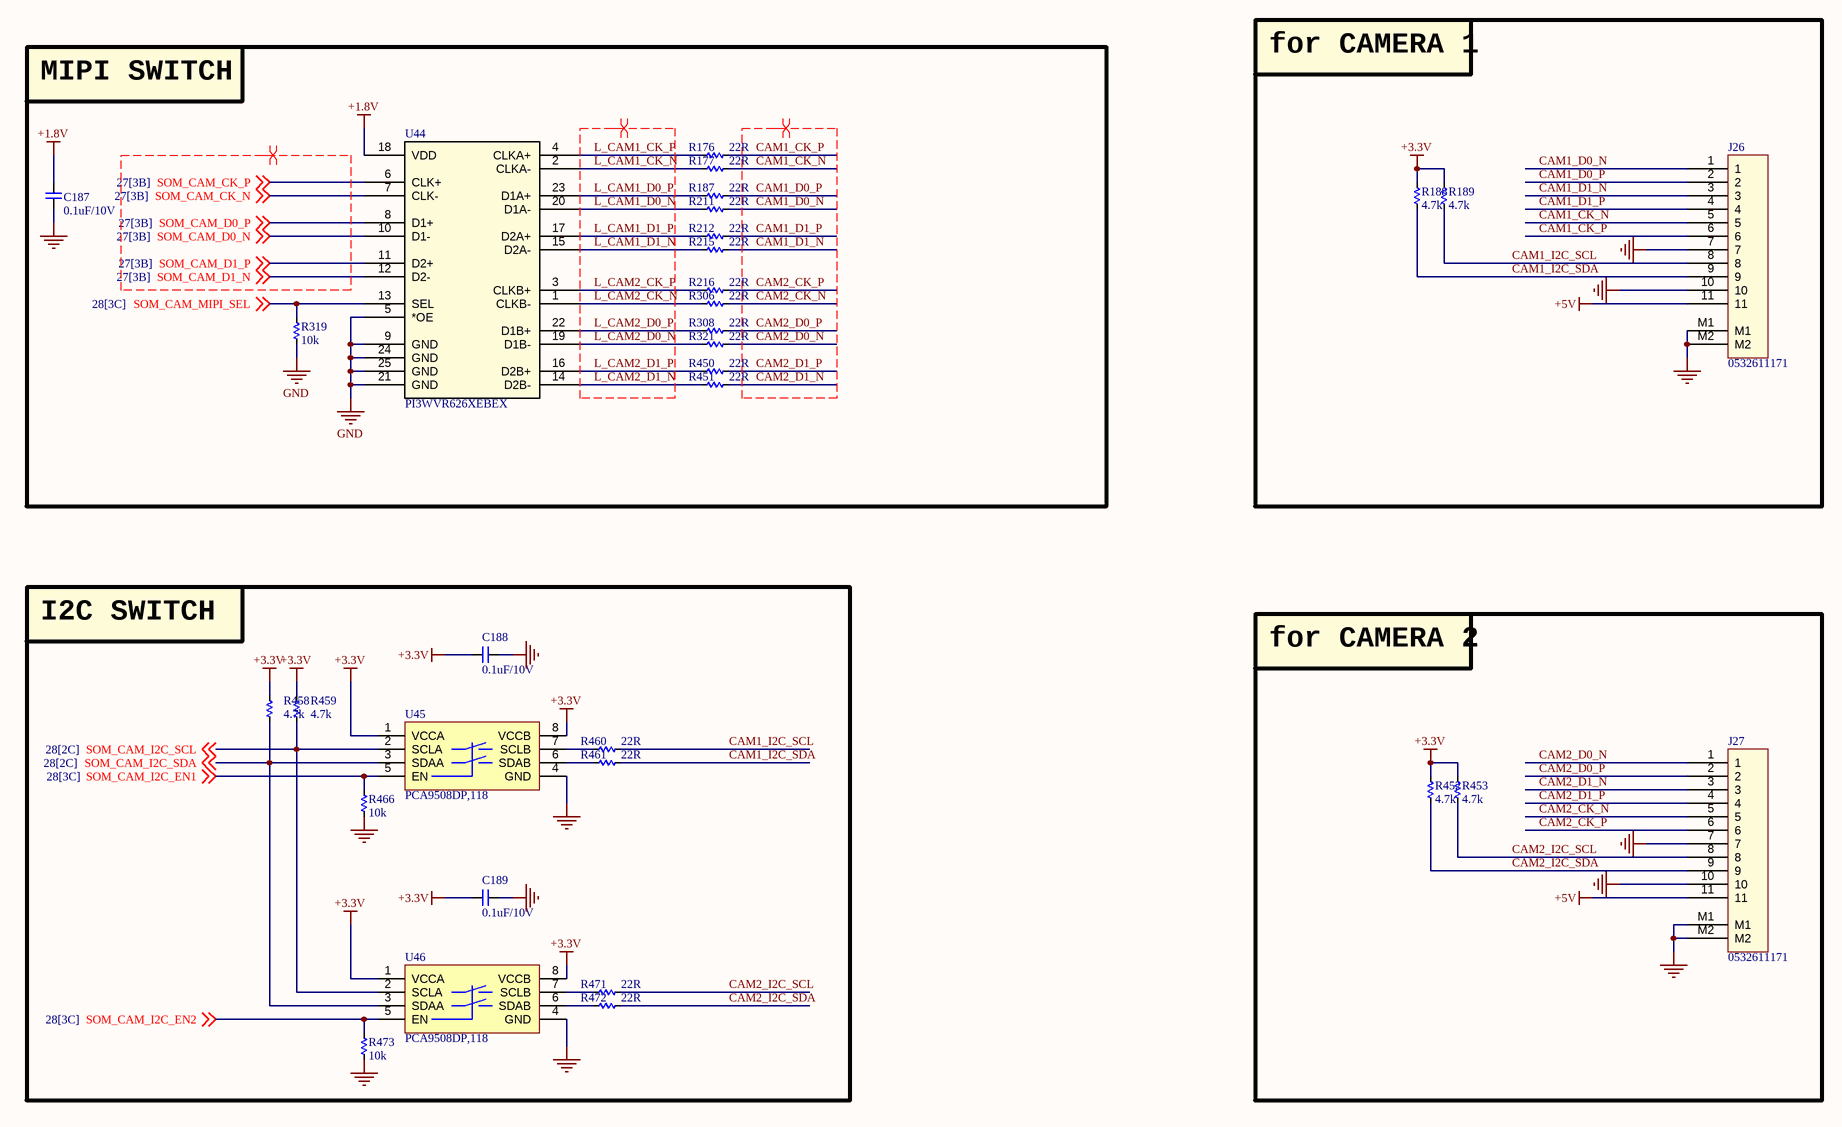
[diagram p10: 06_SOM_CAM.SchDoc]

### Parts
C187  0.1uF/10V  [CAP_C_1005X60]
C188  0.1uF/10V  [CAP_C_1005X60]
C189  0.1uF/10V  [CAP_C_1005X60]
J26  0532611171  [MOLEX_0532611171]
J27  0532611171  [MOLEX_0532611171]
R176  22R  [RES_C_1005X40]
R177  22R  [RES_C_1005X40]
R187  22R  [RES_C_1005X40]
R188  4.7k  [RES_C_1005X40]
R189  4.7k  [RES_C_1005X40]
R211  22R  [RES_C_1005X40]
R212  22R  [RES_C_1005X40]
R215  22R  [RES_C_1005X40]
R216  22R  [RES_C_1005X40]
R306  22R  [RES_C_1005X40]
R308  22R  [RES_C_1005X40]
R319  10k  [RES_C_1005X40]
R321  22R  [RES_C_1005X40]
R450  22R  [RES_C_1005X40]
R451  22R  [RES_C_1005X40]
R452  4.7k  [RES_C_1005X40]
R453  4.7k  [RES_C_1005X40]
R458  4.7k  [RES_C_1005X40]
R459  4.7k  [RES_C_1005X40]
R460  22R  [RES_C_1005X40]
R461  22R  [RES_C_1005X40]
R466  10k  [RES_C_1005X40]
R471  22R  [RES_C_1005X40]
R472  22R  [RES_C_1005X40]
R473  10k  [RES_C_1005X40]
U44  PI3WVR626XEBEX  [PI3WVR626XEBEX_DIO]
U45  PCA9508DP,118  [TSOP8]
U46  PCA9508DP,118  [TSOP8]

### Blocks framed on the sheet
MIPI SWITCH: C187 R176 R177 R187 R211 R212 R215 R216 R306 R308 R319 R321 R450 R451 U44
for CAMERA 1: J26 R188 R189
I2C SWITCH: C188 C189 R458-R461 R466 R471-R473 U45 U46
for CAMERA 2: J27 R452 R453

### Nets
+1.8V: C187.2 U44.18(VDD)
+3.3V: C188.2 C189.2 R188.1 R189.1 R452.1 R453.1 R458.1 R459.1 U45.1(VCCA) U45.8(VCCB) U46.1(VCCA) U46.8(VCCB)
+5V: J26.11 J27.11
GND: C187.1 C188.1 C189.1 J26.7 J26.10 J26.M1 J26.M2 J27.7 J27.10 J27.M1 J27.M2 R319.1 R466.2 R473.2 U44.5(*OE) U44.9(GND) U44.21(GND) U44.24(GND) U44.25(GND) U45.4(GND) U46.4(GND)
CAM1_CK_N: J26.5 R177.2
CAM1_CK_P: J26.6 R176.2
CAM1_D0_N: J26.1 R211.2
CAM1_D0_P: J26.2 R187.2
CAM1_D1_N: J26.3 R215.2
CAM1_D1_P: J26.4 R212.2
CAM1_I2C_SCL: J26.8 R189.2 R460.2
CAM1_I2C_SDA: J26.9 R188.2 R461.2
CAM2_CK_N: J27.5 R306.2
CAM2_CK_P: J27.6 R216.2
CAM2_D0_N: J27.1 R321.2
CAM2_D0_P: J27.2 R308.2
CAM2_D1_N: J27.3 R451.2
CAM2_D1_P: J27.4 R450.2
CAM2_I2C_SCL: J27.8 R453.2 R471.2
CAM2_I2C_SDA: J27.9 R452.2 R472.2
L_CAM1_CK_N: R177.1 U44.2(CLKA-)
L_CAM1_CK_P: R176.1 U44.4(CLKA+)
L_CAM1_D0_N: R211.1 U44.20(D1A-)
L_CAM1_D0_P: R187.1 U44.23(D1A+)
L_CAM1_D1_N: R215.1 U44.15(D2A-)
L_CAM1_D1_P: R212.1 U44.17(D2A+)
L_CAM2_CK_N: R306.1 U44.1(CLKB-)
L_CAM2_CK_P: R216.1 U44.3(CLKB+)
L_CAM2_D0_N: R321.1 U44.19(D1B-)
L_CAM2_D0_P: R308.1 U44.22(D1B+)
L_CAM2_D1_N: R451.1 U44.14(D2B-)
L_CAM2_D1_P: R450.1 U44.16(D2B+)
SOM_CAM_CK_N: U44.7(CLK-) ; off-sheet SOM_CAM_CK_N
SOM_CAM_CK_P: U44.6(CLK+) ; off-sheet SOM_CAM_CK_P
SOM_CAM_D0_N: U44.10(D1-) ; off-sheet SOM_CAM_D0_N
SOM_CAM_D0_P: U44.8(D1+) ; off-sheet SOM_CAM_D0_P
SOM_CAM_D1_N: U44.12(D2-) ; off-sheet SOM_CAM_D1_N
SOM_CAM_D1_P: U44.11(D2+) ; off-sheet SOM_CAM_D1_P
SOM_CAM_I2C_EN1: R466.1 U45.5(EN) ; off-sheet SOM_CAM_I2C_EN1
SOM_CAM_I2C_EN2: R473.1 U46.5(EN) ; off-sheet SOM_CAM_I2C_EN2
SOM_CAM_I2C_SCL: R459.2 U45.2(SCLA) U46.2(SCLA) ; off-sheet SOM_CAM_I2C_SCL
SOM_CAM_I2C_SDA: R458.2 U45.3(SDAA) U46.3(SDAA) ; off-sheet SOM_CAM_I2C_SDA
SOM_CAM_MIPI_SEL: R319.2 U44.13(SEL) ; off-sheet SOM_CAM_MIPI_SEL
NetR460_1: R460.1 U45.7(SCLB)
NetR461_1: R461.1 U45.6(SDAB)
NetR471_1: R471.1 U46.7(SCLB)
NetR472_1: R472.1 U46.6(SDAB)

### Layout directives
differential pair; net class DIFF100; differential pair class DIFF100: CAM1_CK_N, CAM1_CK_P, CAM1_D0_N, CAM1_D0_P, CAM1_D1_N, CAM1_D1_P, CAM2_CK_N, CAM2_CK_P, CAM2_D0_N, CAM2_D0_P, CAM2_D1_N, CAM2_D1_P, L_CAM1_CK_N, L_CAM1_CK_P, L_CAM1_D0_N, L_CAM1_D0_P, L_CAM1_D1_N, L_CAM1_D1_P, L_CAM2_CK_N, L_CAM2_CK_P, L_CAM2_D0_N, L_CAM2_D0_P, L_CAM2_D1_N, L_CAM2_D1_P, SOM_CAM_CK_N, SOM_CAM_CK_P, SOM_CAM_D0_N, SOM_CAM_D0_P, SOM_CAM_D1_N, SOM_CAM_D1_P

### Notes on the sheet
- Project:
- Sub-system:
- Design by:
- Sheet title:
- Sheet
- of
- Checked by:
- Approved by:
- Revision:
- Document No:
- Size:
- Date:
- A3

### Library data of the parts
C187-C189 = _CAP_C_2: CAP CHIP
J26 J27 = Header 11x1_2M
R176 R177 R187-R189 R211 R212 R215 R216 R306 R308 R319 R321 R450-R453 R458-R461 R466 R471-R473 = _RES_B_2: RES
U44 = PI3WVR626XEBEX: Mfr_Name: Diodes Inc; RefDes: RefDes; Type: Type

## Sheet 07_eMMC.SchDoc
size 420 x 297 mm; SheetNumber: 13; SheetTotal: 29
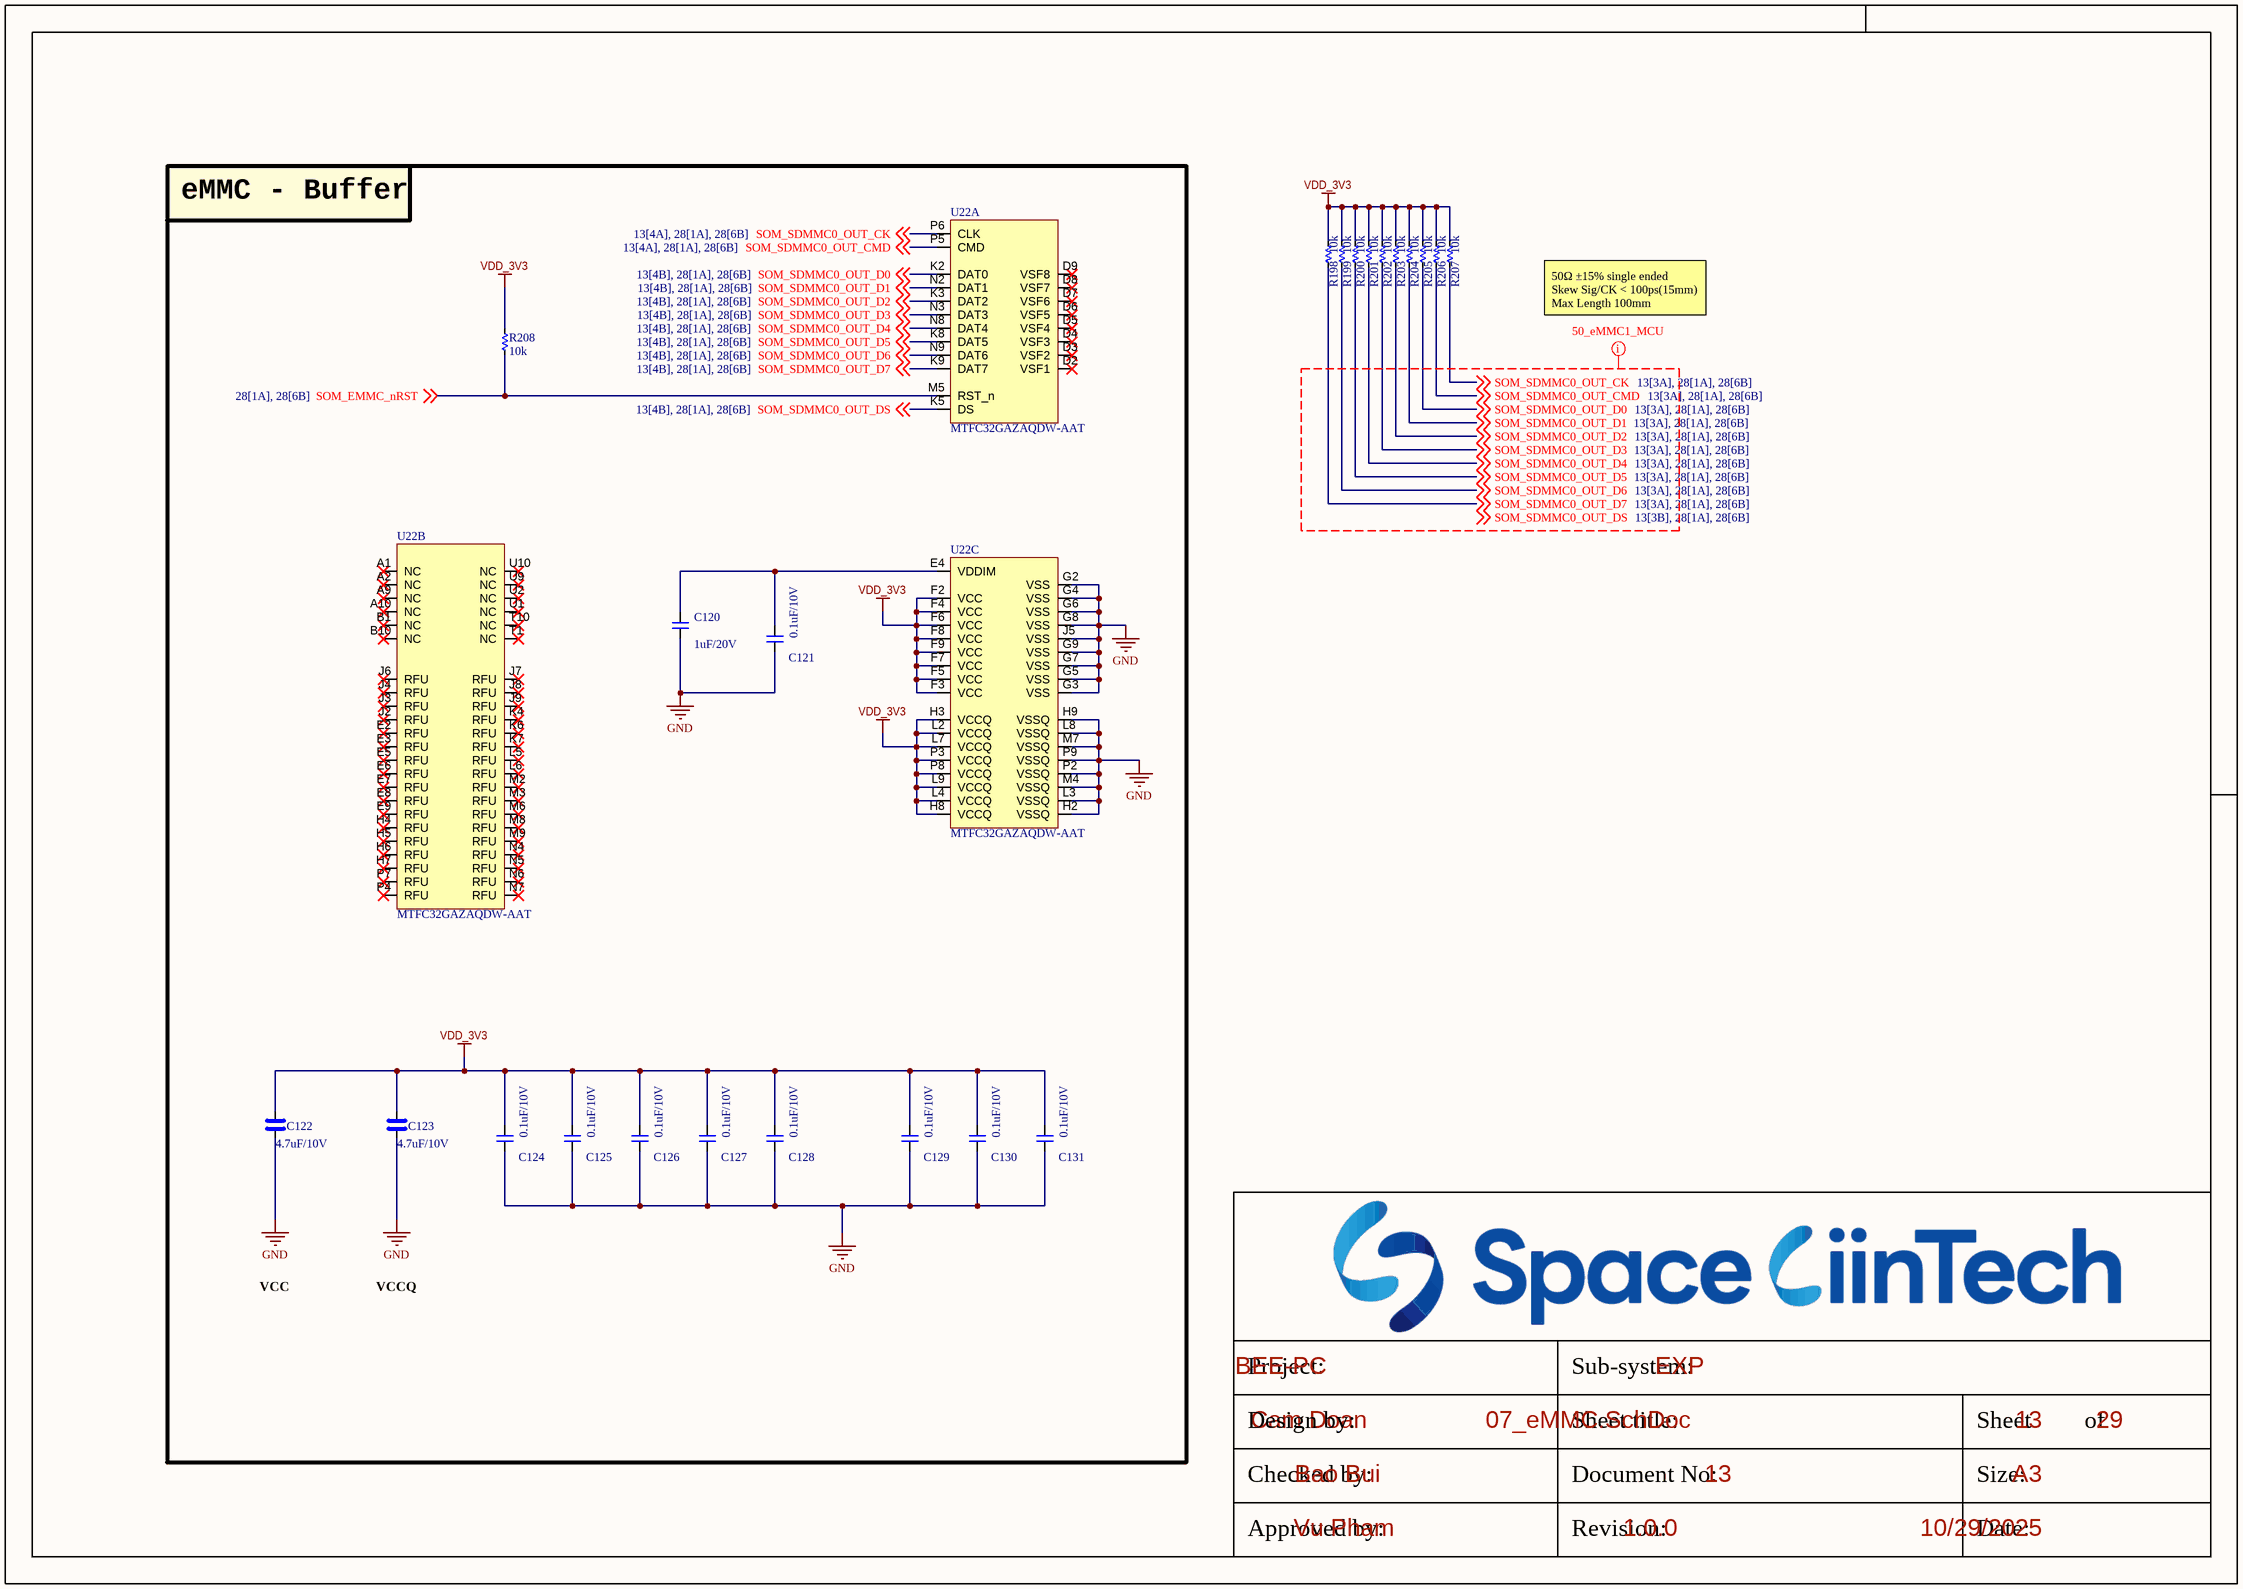
[diagram p11: 07_eMMC.SchDoc]

### Parts
C120  1uF/20V  [CAP_C_1005X60]
C121  0.1uF/10V  [CAP_C_1005X60]
C122  4.7uF/10V  [CAP_C_1005X60]
C123  4.7uF/10V  [CAP_C_1005X60]
C124  0.1uF/10V  [CAP_C_1005X60]
C125  0.1uF/10V  [CAP_C_1005X60]
C126  0.1uF/10V  [CAP_C_1005X60]
C127  0.1uF/10V  [CAP_C_1005X60]
C128  0.1uF/10V  [CAP_C_1005X60]
C129  0.1uF/10V  [CAP_C_1005X60]
C130  0.1uF/10V  [CAP_C_1005X60]
C131  0.1uF/10V  [CAP_C_1005X60]
R198  10k  [RES_C_1005X40]
R199  10k  [RES_C_1005X40]
R200  10k  [RES_C_1005X40]
R201  10k  [RES_C_1005X40]
R202  10k  [RES_C_1005X40]
R203  10k  [RES_C_1005X40]
R204  10k  [RES_C_1005X40]
R205  10k  [RES_C_1005X40]
R206  10k  [RES_C_1005X40]
R207  10k  [RES_C_1005X40]
R208  10k  [RES_C_1005X40]
U22  MTFC32GAZAQDW-AAT  [BGA_100_C_100P_10X17_1400X1800X150]  (parts A,B,C of 3)

### Blocks framed on the sheet
eMMC - Buffer: C120-C131 R208 U22

### Nets
GND: C120.1 C121.1 C122.1 C123.1 C124.1 C125.1 C126.1 C127.1 C128.1 C129.1 C130.1 C131.1 U22.G2(VSS) U22.G3(VSS) U22.G4(VSS) U22.G5(VSS) U22.G6(VSS) U22.G7(VSS) U22.G8(VSS) U22.G9(VSS) U22.H2(VSSQ) U22.H9(VSSQ) U22.J5(VSS) U22.L3(VSSQ) U22.L8(VSSQ) U22.M4(VSSQ) U22.M7(VSSQ) U22.P2(VSSQ) U22.P9(VSSQ)
VDD_3V3: C122.2 C123.2 C124.2 C125.2 C126.2 C127.2 C128.2 C129.2 C130.2 C131.2 R198.2 R199.2 R200.2 R201.2 R202.2 R203.2 R204.2 R205.2 R206.2 R207.2 R208.2 U22.F2(VCC) U22.F3(VCC) U22.F4(VCC) U22.F5(VCC) U22.F6(VCC) U22.F7(VCC) U22.F8(VCC) U22.F9(VCC) U22.H3(VCCQ) U22.H8(VCCQ) U22.L2(VCCQ) U22.L4(VCCQ) U22.L7(VCCQ) U22.L9(VCCQ) U22.P3(VCCQ) U22.P8(VCCQ)
SOM_EMMC_nRST: R208.1 U22.M5(RST_n) ; off-sheet SOM_EMMC_nRST
SOM_SDMMC0_OUT_CK: R207.1 U22.P6(CLK) ; off-sheet SOM_SDMMC0_OUT_CK
SOM_SDMMC0_OUT_CMD: R206.1 U22.P5(CMD) ; off-sheet SOM_SDMMC0_OUT_CMD
SOM_SDMMC0_OUT_D0: R205.1 U22.K2(DAT0) ; off-sheet SOM_SDMMC0_OUT_D0
SOM_SDMMC0_OUT_D1: R204.1 U22.N2(DAT1) ; off-sheet SOM_SDMMC0_OUT_D1
SOM_SDMMC0_OUT_D2: R203.1 U22.K3(DAT2) ; off-sheet SOM_SDMMC0_OUT_D2
SOM_SDMMC0_OUT_D3: R202.1 U22.N3(DAT3) ; off-sheet SOM_SDMMC0_OUT_D3
SOM_SDMMC0_OUT_D4: R201.1 U22.N8(DAT4) ; off-sheet SOM_SDMMC0_OUT_D4
SOM_SDMMC0_OUT_D5: R200.1 U22.K8(DAT5) ; off-sheet SOM_SDMMC0_OUT_D5
SOM_SDMMC0_OUT_D6: R199.1 U22.N9(DAT6) ; off-sheet SOM_SDMMC0_OUT_D6
SOM_SDMMC0_OUT_D7: R198.1 U22.K9(DAT7) ; off-sheet SOM_SDMMC0_OUT_D7
SOM_SDMMC0_OUT_DS: U22.K5(DS) ; off-sheet SOM_SDMMC0_OUT_DS
NetC120_2: C120.2 C121.2 U22.E4(VDDIM)

Not connected (* = marked no-connect by the designer): U22 A1(NC)* A2(NC)* A9(NC)* A10(NC)* B1(NC)* B10(NC)* D2(VSF1)* D3(VSF2)* D4(VSF3)* D5(VSF4)* D6(VSF5)* D7(VSF6)* D8(VSF7)* D9(VSF8)* E2(RFU)* E3(RFU)* E5(RFU)* E6(RFU)* E7(RFU)* E8(RFU)* E9(RFU)* H4(RFU)* H5(RFU)* H6(RFU)* H7(RFU)* J2(RFU)* J3(RFU)* J4(RFU)* J6(RFU)* J7(RFU)* J8(RFU)* J9(RFU)* K4(RFU)* K6(RFU)* K7(RFU)* L5(RFU)* L6(RFU)* M2(RFU)* M3(RFU)* M6(RFU)* M8(RFU)* M9(RFU)* N4(RFU)* N5(RFU)* N6(RFU)* N7(RFU)* P4(RFU)* P7(RFU)* T1(NC)* T10(NC)* U1(NC)* U2(NC)* U9(NC)* U10(NC)*

### Layout directives
net class 50_eMMC1_MCU: SOM_SDMMC0_OUT_CK, SOM_SDMMC0_OUT_CMD, SOM_SDMMC0_OUT_D0, SOM_SDMMC0_OUT_D1, SOM_SDMMC0_OUT_D2, SOM_SDMMC0_OUT_D3, SOM_SDMMC0_OUT_D4, SOM_SDMMC0_OUT_D5, SOM_SDMMC0_OUT_D6, SOM_SDMMC0_OUT_D7, SOM_SDMMC0_OUT_DS

### Notes on the sheet
- 50Ω ±15% single ended
  Skew Sig/CK < 100ps(15mm)
  Max Length 100mm
- VCC
- VCCQ
- Labels drawn without touching a wire or pin: SOM_SDMMC0_OUT_DS
- Project:
- Sub-system:
- Design by:
- Sheet title:
- Sheet
- of
- Checked by:
- Approved by:
- Revision:
- Document No:
- Size:
- Date:
- A3

### Library data of the parts
C120 C121 C124-C131 = _CAP_C_2: CAP CHIP
C122 C123 = _CAP_C_High_2: CAP CHIP High Value
R198-R208 = _RES_B_2: RES

## Sheet 07_USB.SchDoc
size 420 x 297 mm; SheetNumber: 14; SheetTotal: 28
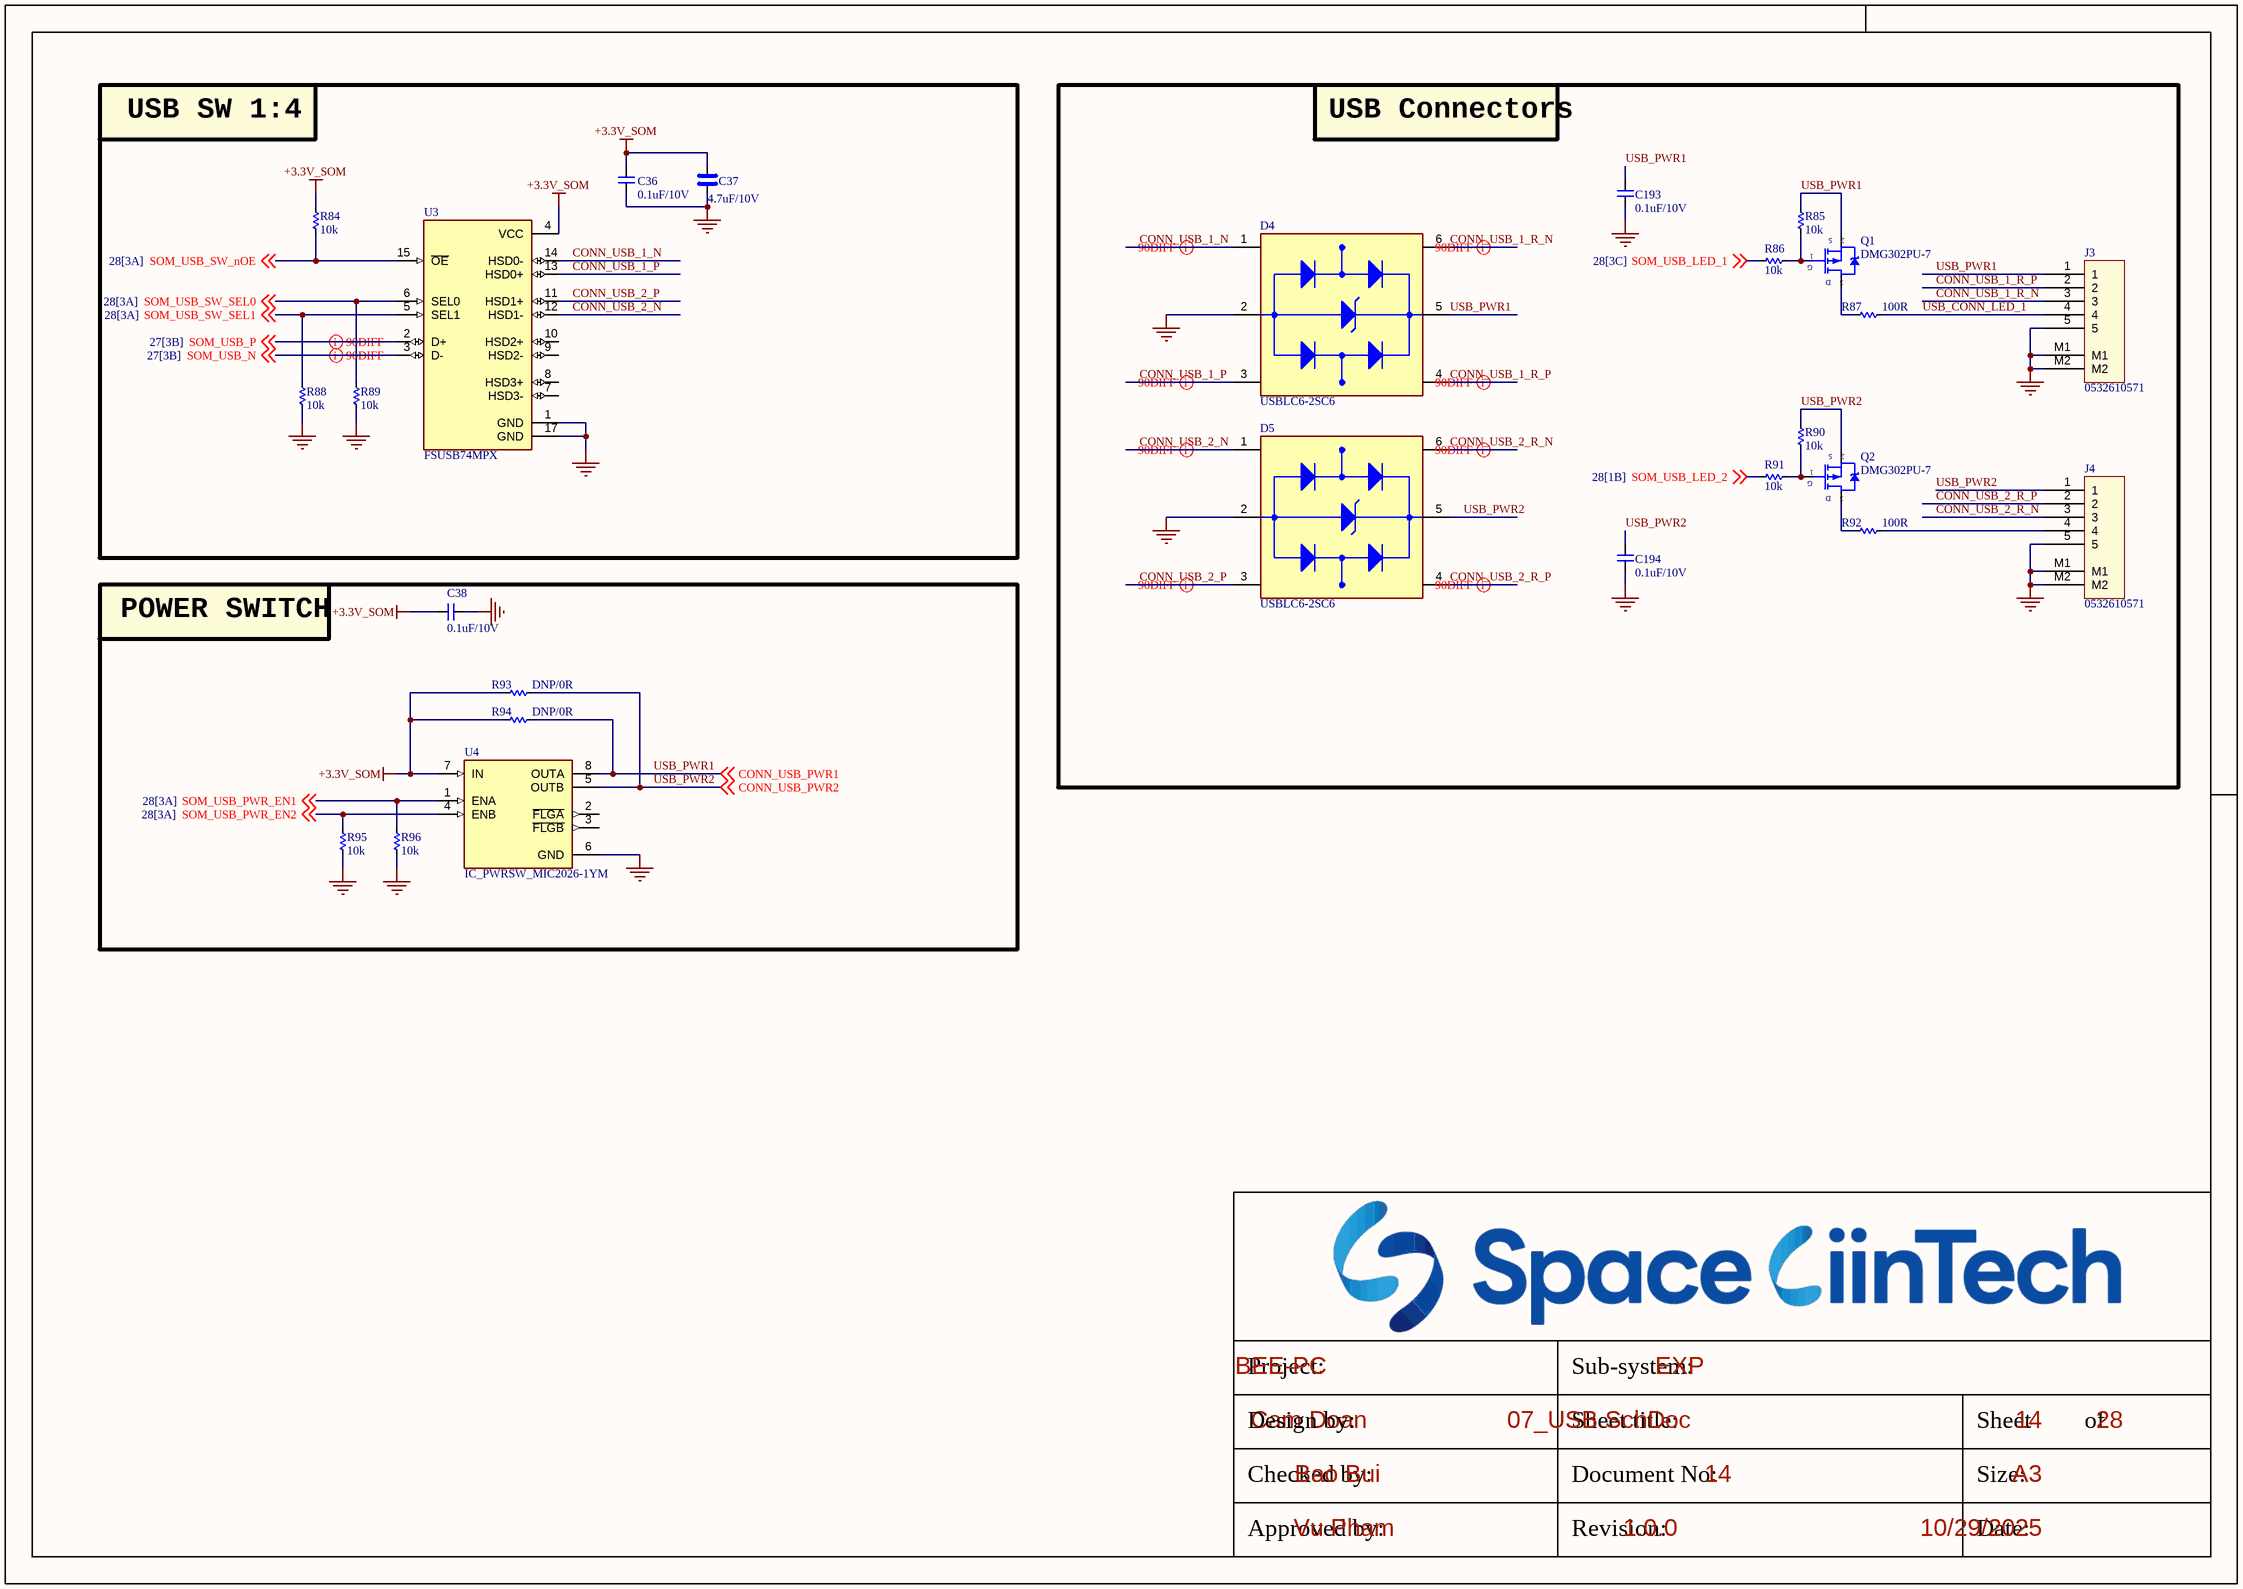
[diagram p12: 07_USB.SchDoc]

### Parts
C36  0.1uF/10V  [CAP_C_1005X60]
C37  4.7uF/10V  [CAP_C_1005X60]
C38  0.1uF/10V  [CAP_C_1005X60]
C193  0.1uF/10V  [CAP_C_1005X60]
C194  0.1uF/10V  [CAP_C_1005X60]
D4  USBLC6-2SC6  [SOT95P280X145-6N]
D5  USBLC6-2SC6  [SOT95P280X145-6N]
J3  0532610571  [MOLEX_0532610571]
J4  0532610571  [MOLEX_0532610571]
Q1  DMG302PU-7  [SOT95P240X120-3N]
Q2  DMG302PU-7  [SOT95P240X120-3N]
R84  10k  [RES_C_1005X40]
R85  10k  [RES_C_1005X40]
R86  10k  [RES_C_1005X40]
R87  100R  [RES_C_1005X40]
R88  10k  [RES_C_1005X40]
R89  10k  [RES_C_1005X40]
R90  10k  [RES_C_1005X40]
R91  10k  [RES_C_1005X40]
R92  100R  [RES_C_1005X40]
R93  DNP/0R  [RES_C_1005X40]
R94  DNP/0R  [RES_C_1005X40]
R95  10k  [RES_C_1005X40]
R96  10k  [RES_C_1005X40]
U3  FSUSB74MPX  [QFN50P300X300X80-17N]
U4  IC_PWRSW_MIC2026-1YM  [SOIC127P602X173-8N]

### Blocks framed on the sheet
USB SW 1:4: C36 C37 R84 R88 R89 U3
USB Connectors: C193 C194 D4 D5 J3 J4 Q1 Q2 R85-R87 R90-R92
POWER SWITCH: C38 R93-R96 U4

### Nets
+3.3V_SOM: C36.2 C37.2 C38.2 R84.1 R93.2 R94.2 U3.4(VCC) U4.7(IN)
GND: C36.1 C37.1 C38.1 C193.1 C194.1 D4.2(GND) D5.2(GND) J3.5 J3.M1 J3.M2 J4.5 J4.M1 J4.M2 R88.2 R89.2 R95.2 R96.2 U3.1(GND) U3.17(GND) U4.6(GND)
CONN_USB_1_N: D4.1(I/O1_IN) U3.14(HSD0-)
CONN_USB_1_P: D4.3(I/O2_IN) U3.13(HSD0+)
CONN_USB_1_R_N: D4.6(I/O1_OUT) J3.3
CONN_USB_1_R_P: D4.4(I/O2_OUT) J3.2
CONN_USB_2_N: D5.1(I/O1_IN) U3.12(HSD1-)
CONN_USB_2_P: D5.3(I/O2_IN) U3.11(HSD1+)
CONN_USB_2_R_N: D5.6(I/O1_OUT) J4.3
CONN_USB_2_R_P: D5.4(I/O2_OUT) J4.2
SOM_USB_LED_1: R86.1 ; off-sheet SOM_USB_LED_1
SOM_USB_LED_2: R91.1 ; off-sheet SOM_USB_LED_2
SOM_USB_N: U3.3(D-) ; off-sheet SOM_USB_N
SOM_USB_P: U3.2(D+) ; off-sheet SOM_USB_P
SOM_USB_PWR_EN1: R96.1 U4.1(ENA) ; off-sheet SOM_USB_PWR_EN1
SOM_USB_PWR_EN2: R95.1 U4.4(ENB) ; off-sheet SOM_USB_PWR_EN2
SOM_USB_SW_nOE: R84.2 U3.15(~{OE}) ; off-sheet SOM_USB_SW_nOE
SOM_USB_SW_SEL0: R89.1 U3.6(SEL0) ; off-sheet SOM_USB_SW_SEL0
SOM_USB_SW_SEL1: R88.1 U3.5(SEL1) ; off-sheet SOM_USB_SW_SEL1
USB_CONN_LED_1: J3.4 R87.2
USB_PWR1: C193.2 D4.5(VBUS) J3.1 Q1.2(S) R85.1 R94.1 U4.8(OUTA) ; off-sheet CONN_USB_PWR1  [also labelled CONN_USB_PWR1]
USB_PWR2: C194.2 D5.5(VBUS) J4.1 Q2.2(S) R90.1 R93.1 U4.5(OUTB) ; off-sheet CONN_USB_PWR2  [also labelled CONN_USB_PWR2]
NetJ4_4: J4.4 R92.2
NetQ1_1: Q1.1(G) R85.2 R86.2
NetQ1_3: Q1.3(D) R87.1
NetQ2_1: Q2.1(G) R90.2 R91.2
NetQ2_3: Q2.3(D) R92.1

Not connected (* = marked no-connect by the designer): U3 7(HSD3-) 8(HSD3+) 9(HSD2-) 10(HSD2+); U4 2(~{FLGA}) 3(~{FLGB})

### Layout directives
differential pair; differential pair class DIFF90: CONN_USB_1_N, CONN_USB_1_P, CONN_USB_1_R_N, CONN_USB_1_R_P, CONN_USB_2_N, CONN_USB_2_P, CONN_USB_2_R_N, CONN_USB_2_R_P, SOM_USB_N, SOM_USB_P

### Notes on the sheet
- Project:
- Sub-system:
- Design by:
- Sheet title:
- Sheet
- of
- Checked by:
- Approved by:
- Revision:
- Document No:
- Size:
- Date:
- A3

### Library data of the parts
C36 C38 C193 C194 = _CAP_C_2: CAP CHIP
C37 = _CAP_C_High_2: CAP CHIP High Value
D4 D5 = USBLC6-2SC6: as D2 on sheet 04_CONNECTOR_IN; Value: *; SnapEDA_Link: https://www.snapeda.com/parts/USBLC6-2SC6/STMicroelectronics/view-part/?ref=snap; Check_prices: https://www.snapeda.com/parts/USBLC6-2SC6/STMicroelectronics/view-part/?ref=eda; Purchase-URL: https://pricing.snapeda.com/search/part/USBLC6-2SC6/?ref=eda; Price: None; Availability: In Stock; Package: SOT-23-6 STMicroelectronics; MP: USBLC6-2SC6
J3 J4 = Header 5x1_2M
Q1 Q2 = MOSFET_P_GSD
R84-R96 = _RES_B_2: RES
U3 = IC_USB_SW_FSUSB74MPX: USB Switch IC 1 Channel 16-MLP (3x3); MF: ON Semiconductor; SnapEDA_Link: https://www.snapeda.com/parts/FSUSB74MPX/Onsemi/view-part/?ref=snap; Package: WQFN-16 ON Semiconductor; Value: *; MP: FSUSB74MPX; Check_prices: https://www.snapeda.com/parts/FSUSB74MPX/Onsemi/view-part/?ref=eda
U4 = IC_PWRSW_MIC2026-1YM: Power Switch/Driver 1:2 N-Channel 1.25A 8-SOIC; MF: Microchip; SnapEDA_Link: https://www.snapeda.com/parts/MIC2026-1YM/Microchip/view-part/?ref=snap; Package: SO-8 Microchip; Value: *; MP: MIC2026-1YM; Check_prices: https://www.snapeda.com/parts/MIC2026-1YM/Microchip/view-part/?ref=eda